# EAGLE design VESC_Dev_1 (EAGLE 9.4.2)

## Sheet 1 of 6
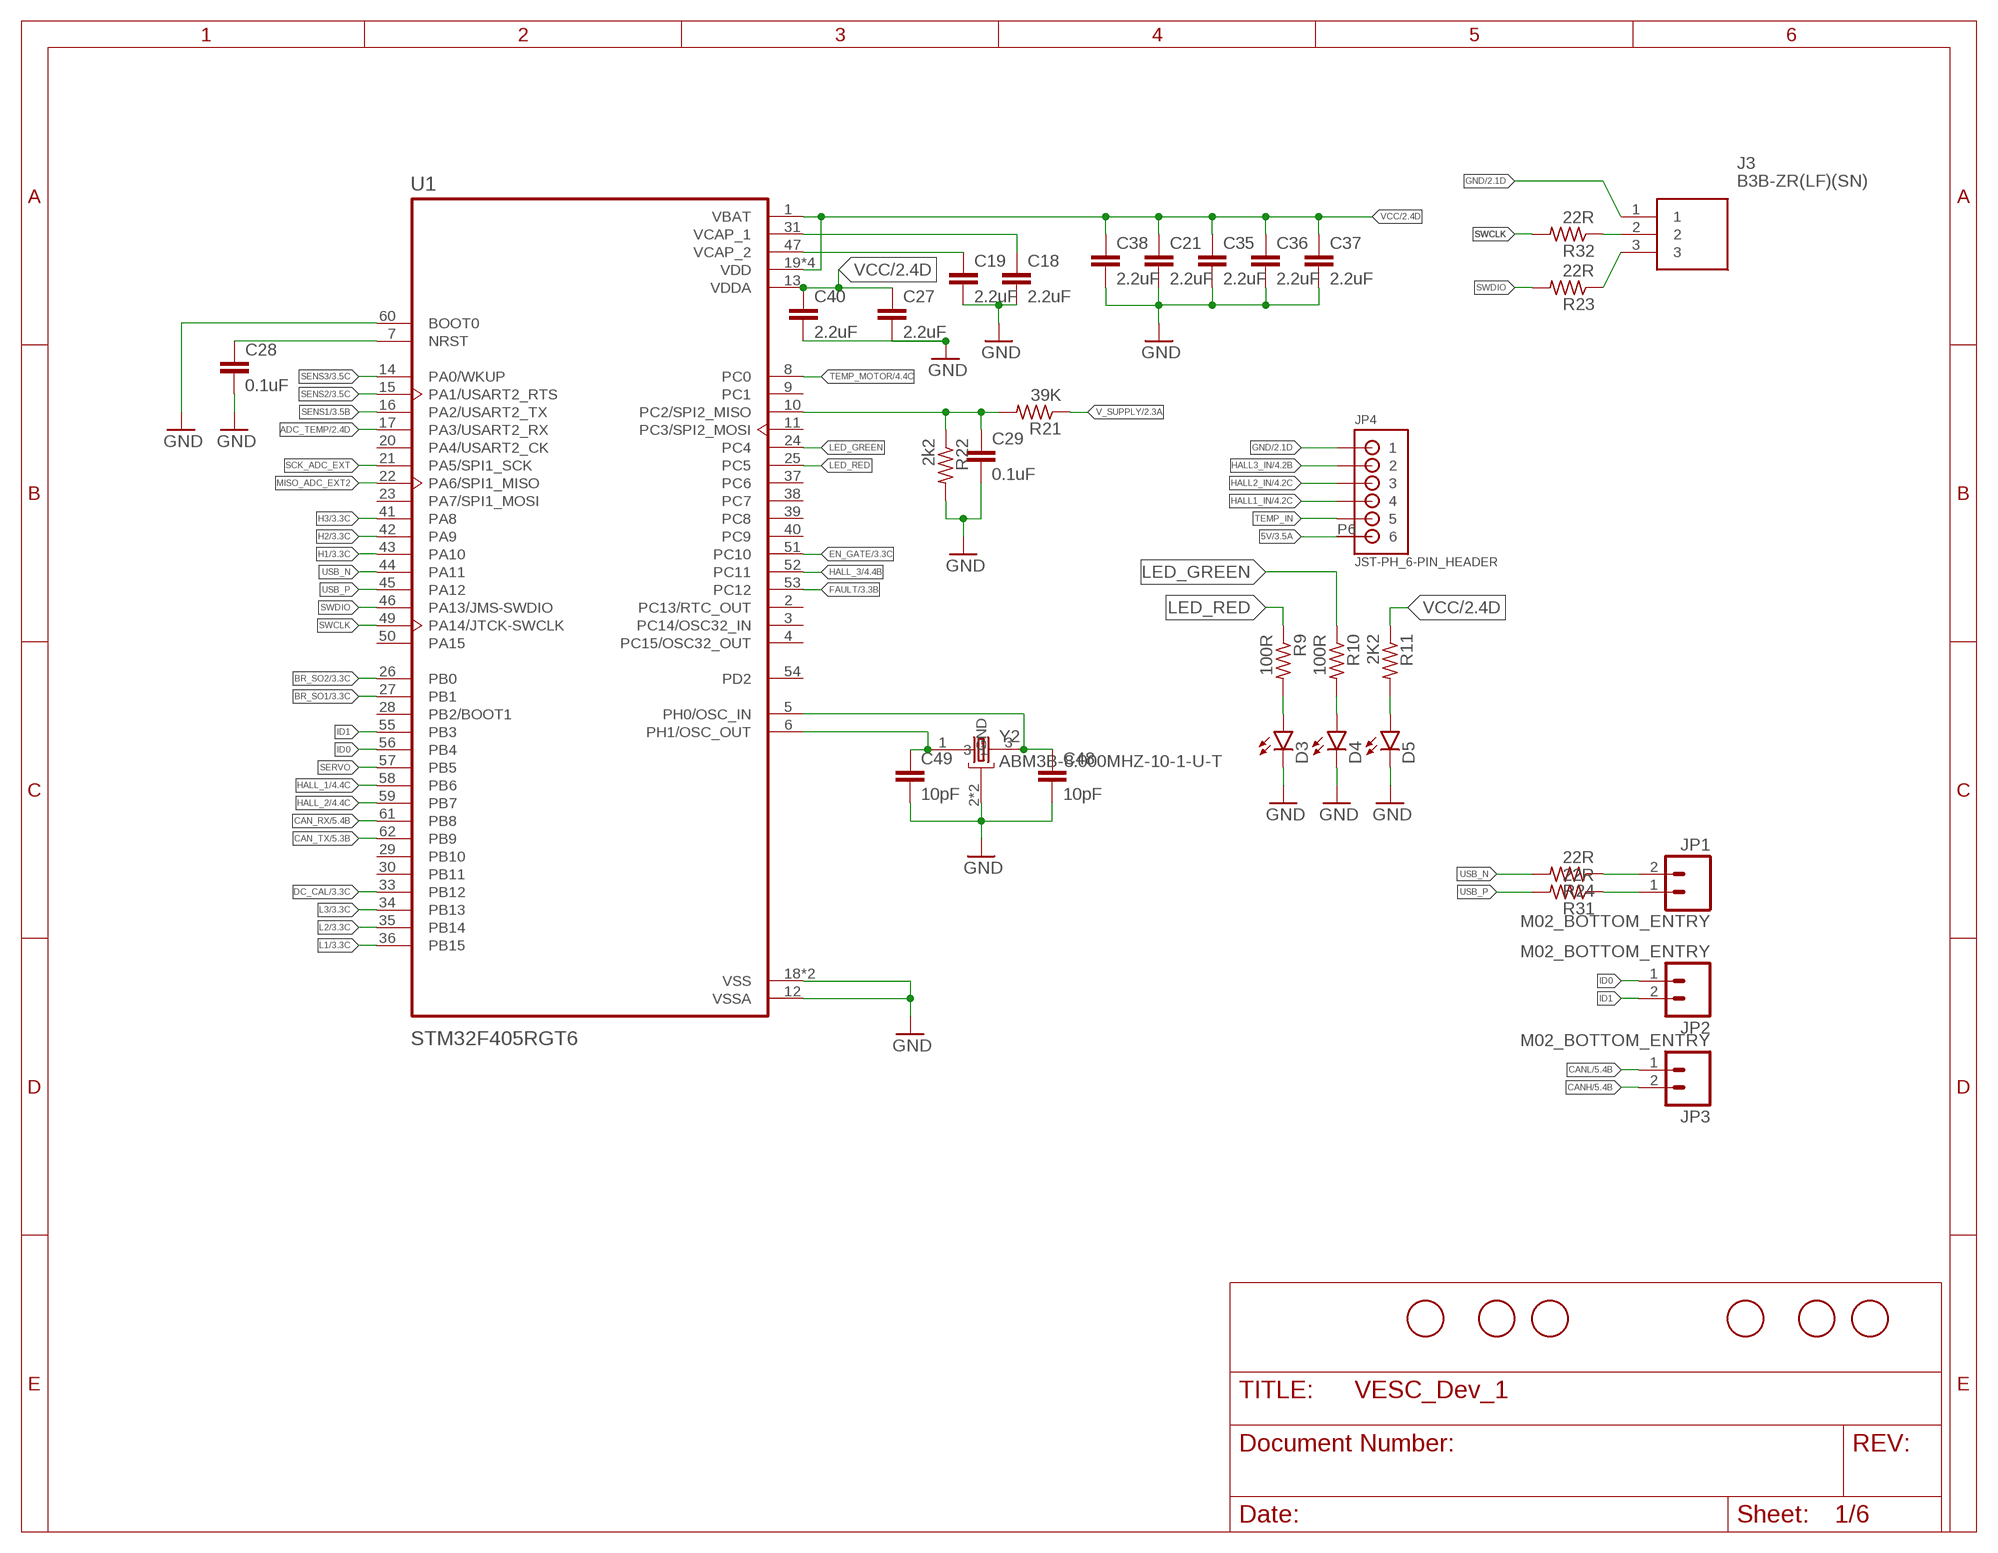
[diagram p0: schematic, sheet 1]

### Parts
C18  2.2uF  C-EUC0603  [C0603]
C19  2.2uF  C-EUC0603  [C0603]
C21  2.2uF  C-EUC0603  [C0603]
C27  2.2uF  C-EUC0603  [C0603]
C28  0.1uF  C-EUC0603  [C0603]
C29  0.1uF  C-EUC0603  [C0603]
C35  2.2uF  C-EUC0603  [C0603]
C36  2.2uF  C-EUC0402  [C0402]
C37  2.2uF  C-EUC0603  [C0603]
C38  2.2uF  C-EUC0603  [C0603]
C40  2.2uF  C-EUC0603  [C0603]
C48  10pF  C-EUC0603  [C0603]
C49  10pF  C-EUC0603  [C0603]
D3  LEDSML0603  [SML0603]
D4  LEDSML0603  [SML0603]
D5  LEDSML0603  [SML0603]
J3  B3B-ZR(LF)(SN)  [SHDR3W50P0X150_1X3_600X350X450]
JP1  M02_BOTTOM_ENTRY  [1X02_BOTTOM_ENTRY]
JP2  M02_BOTTOM_ENTRY  [1X02_BOTTOM_ENTRY]
JP3  M02_BOTTOM_ENTRY  [1X02_BOTTOM_ENTRY]
JP4  JST-PH_6-PIN_HEADER  [JST_B6B-PH_HEADER]
R9  100R  R-US_R0603  [R0603]
R10  100R  R-US_R0603  [R0603]
R11  2K2  R-US_R0603  [R0603]
R21  39K  R-US_R0603  [R0603]
R22  2k2  R-US_R0603  [R0603]
R23  22R  R-US_R0603  [R0603]
R24  22R  R-US_R0603  [R0603]
R31  22R  R-US_R0603  [R0603]
R32  22R  R-US_R0603  [R0603]
U1  STM32F405RGT6  [QFP50P1200X1200X160-64N]
U$1  FIDUCIAL  [FIDUCIAL_1MM]
U$2  FIDUCIAL  [FIDUCIAL_1MM]
U$3  FIDUCIAL  [FIDUCIAL_1MM]
U$4  FIDUCIAL  [FIDUCIAL_1MM]
U$5  FIDUCIAL  [FIDUCIAL_1MM]
U$6  FIDUCIAL  [FIDUCIAL_1MM]
Y2  ABM3B-8.000MHZ-10-1-U-T  [OSCCC500X320X110-4N]

### Nets
5V: JP4.P6 ; also sheet 3
ADC_TEMP: U1.17(PA3/USART2_RX) ; also sheet 2
BR_SO1: U1.27(PB1) ; also sheet 3
BR_SO2: U1.26(PB0) ; also sheet 3
CAN_RX: U1.61(PB8) ; also sheet 5
CAN_TX: U1.62(PB9) ; also sheet 5
CANH: JP3.2 ; also sheet 5
CANL: JP3.1 ; also sheet 5
DC_CAL: U1.33(PB12) ; also sheet 3
EN_GATE: U1.51(PC10) ; also sheet 3
FAULT: U1.53(PC12) ; also sheet 3
GND: C18.2 C19.2 C21.2 C27.2 C28.2 C29.2 C35.2 C36.2 C37.2 C38.2 C40.2 C48.2 C49.2 D3.C D4.C D5.C J3.1 JP4.P1 R22.2 U1.12(VSSA) U1.18(VSS) U1.60(BOOT0) U1.63(VSS) Y2.2(GND) Y2.4(GND) ; also sheet 2,3,4,5
H1: U1.43(PA10) ; also sheet 3
H2: U1.42(PA9) ; also sheet 3
H3: U1.41(PA8) ; also sheet 3
HALL1_IN: JP4.P4 ; also sheet 4
HALL2_IN: JP4.P3 ; also sheet 4
HALL3_IN: JP4.P2 ; also sheet 4
HALL_1: U1.58(PB6) ; also sheet 4
HALL_2: U1.59(PB7) ; also sheet 4
HALL_3: U1.52(PC11) ; also sheet 4
ID0: JP2.1 U1.56(PB4)
ID1: JP2.2 U1.55(PB3)
L1: U1.36(PB15) ; also sheet 3
L2: U1.35(PB14) ; also sheet 3
L3: U1.34(PB13) ; also sheet 3
LED_GREEN: R10.1 U1.24(PC4)
LED_RED: R9.1 U1.25(PC5)
MISO_ADC_EXT2: U1.22(PA6/SPI1_MISO)
N$1: C28.1 U1.7(NRST)
N$4: J3.2 R32.1
N$11: C29.1 R21.2 R22.1 U1.10(PC2/SPI2_MISO)
N$12: JP1.2 R24.1
N$15: C18.1 U1.31(VCAP_1)
N$19: JP1.1 R31.1
N$21: C19.1 U1.47(VCAP_2)
N$22: C49.1 U1.6(PH1/OSC_OUT) Y2.1
N$23: C48.1 U1.5(PH0/OSC_IN) Y2.3
N$26: J3.3 R23.1
N$69: D3.A R9.2
N$71: D4.A R10.2
N$73: D5.A R11.2
SCK_ADC_EXT: U1.21(PA5/SPI1_SCK)
SENS1: U1.16(PA2/USART2_TX) ; also sheet 3
SENS2: U1.15(PA1/USART2_RTS) ; also sheet 3
SENS3: U1.14(PA0/WKUP) ; also sheet 3
SERVO: U1.57(PB5)
SWCLK: R32.2 U1.49(PA14/JTCK-SWCLK)
SWDIO: R23.2 U1.46(PA13/JMS-SWDIO)
TEMP_IN: JP4.P5
TEMP_MOTOR: U1.8(PC0) ; also sheet 4
USB_N [USB]: R24.2 U1.44(PA11)
USB_P [USB]: R31.2 U1.45(PA12)
V_SUPPLY: R21.1 ; also sheet 2,3
VCC: C21.1 C27.1 C35.1 C36.1 C37.1 C38.1 C40.1 R11.1 U1.1(VBAT) U1.13(VDDA) U1.19(VDD) U1.32(VDD) U1.48(VDD) U1.64(VDD) ; also sheet 2,3,4,5
Unconnected: U1.2(PC13/RTC_OUT) U1.3(PC14/OSC32_IN) U1.4(PC15/OSC32_OUT) U1.9(PC1) U1.11(PC3/SPI2_MOSI) U1.20(PA4/USART2_CK) U1.23(PA7/SPI1_MOSI) U1.28(PB2/BOOT1) U1.29(PB10) U1.30(PB11) U1.37(PC6) U1.38(PC7) U1.39(PC8) U1.40(PC9) U1.50(PA15) U1.54(PD2)

## Sheet 2 of 6
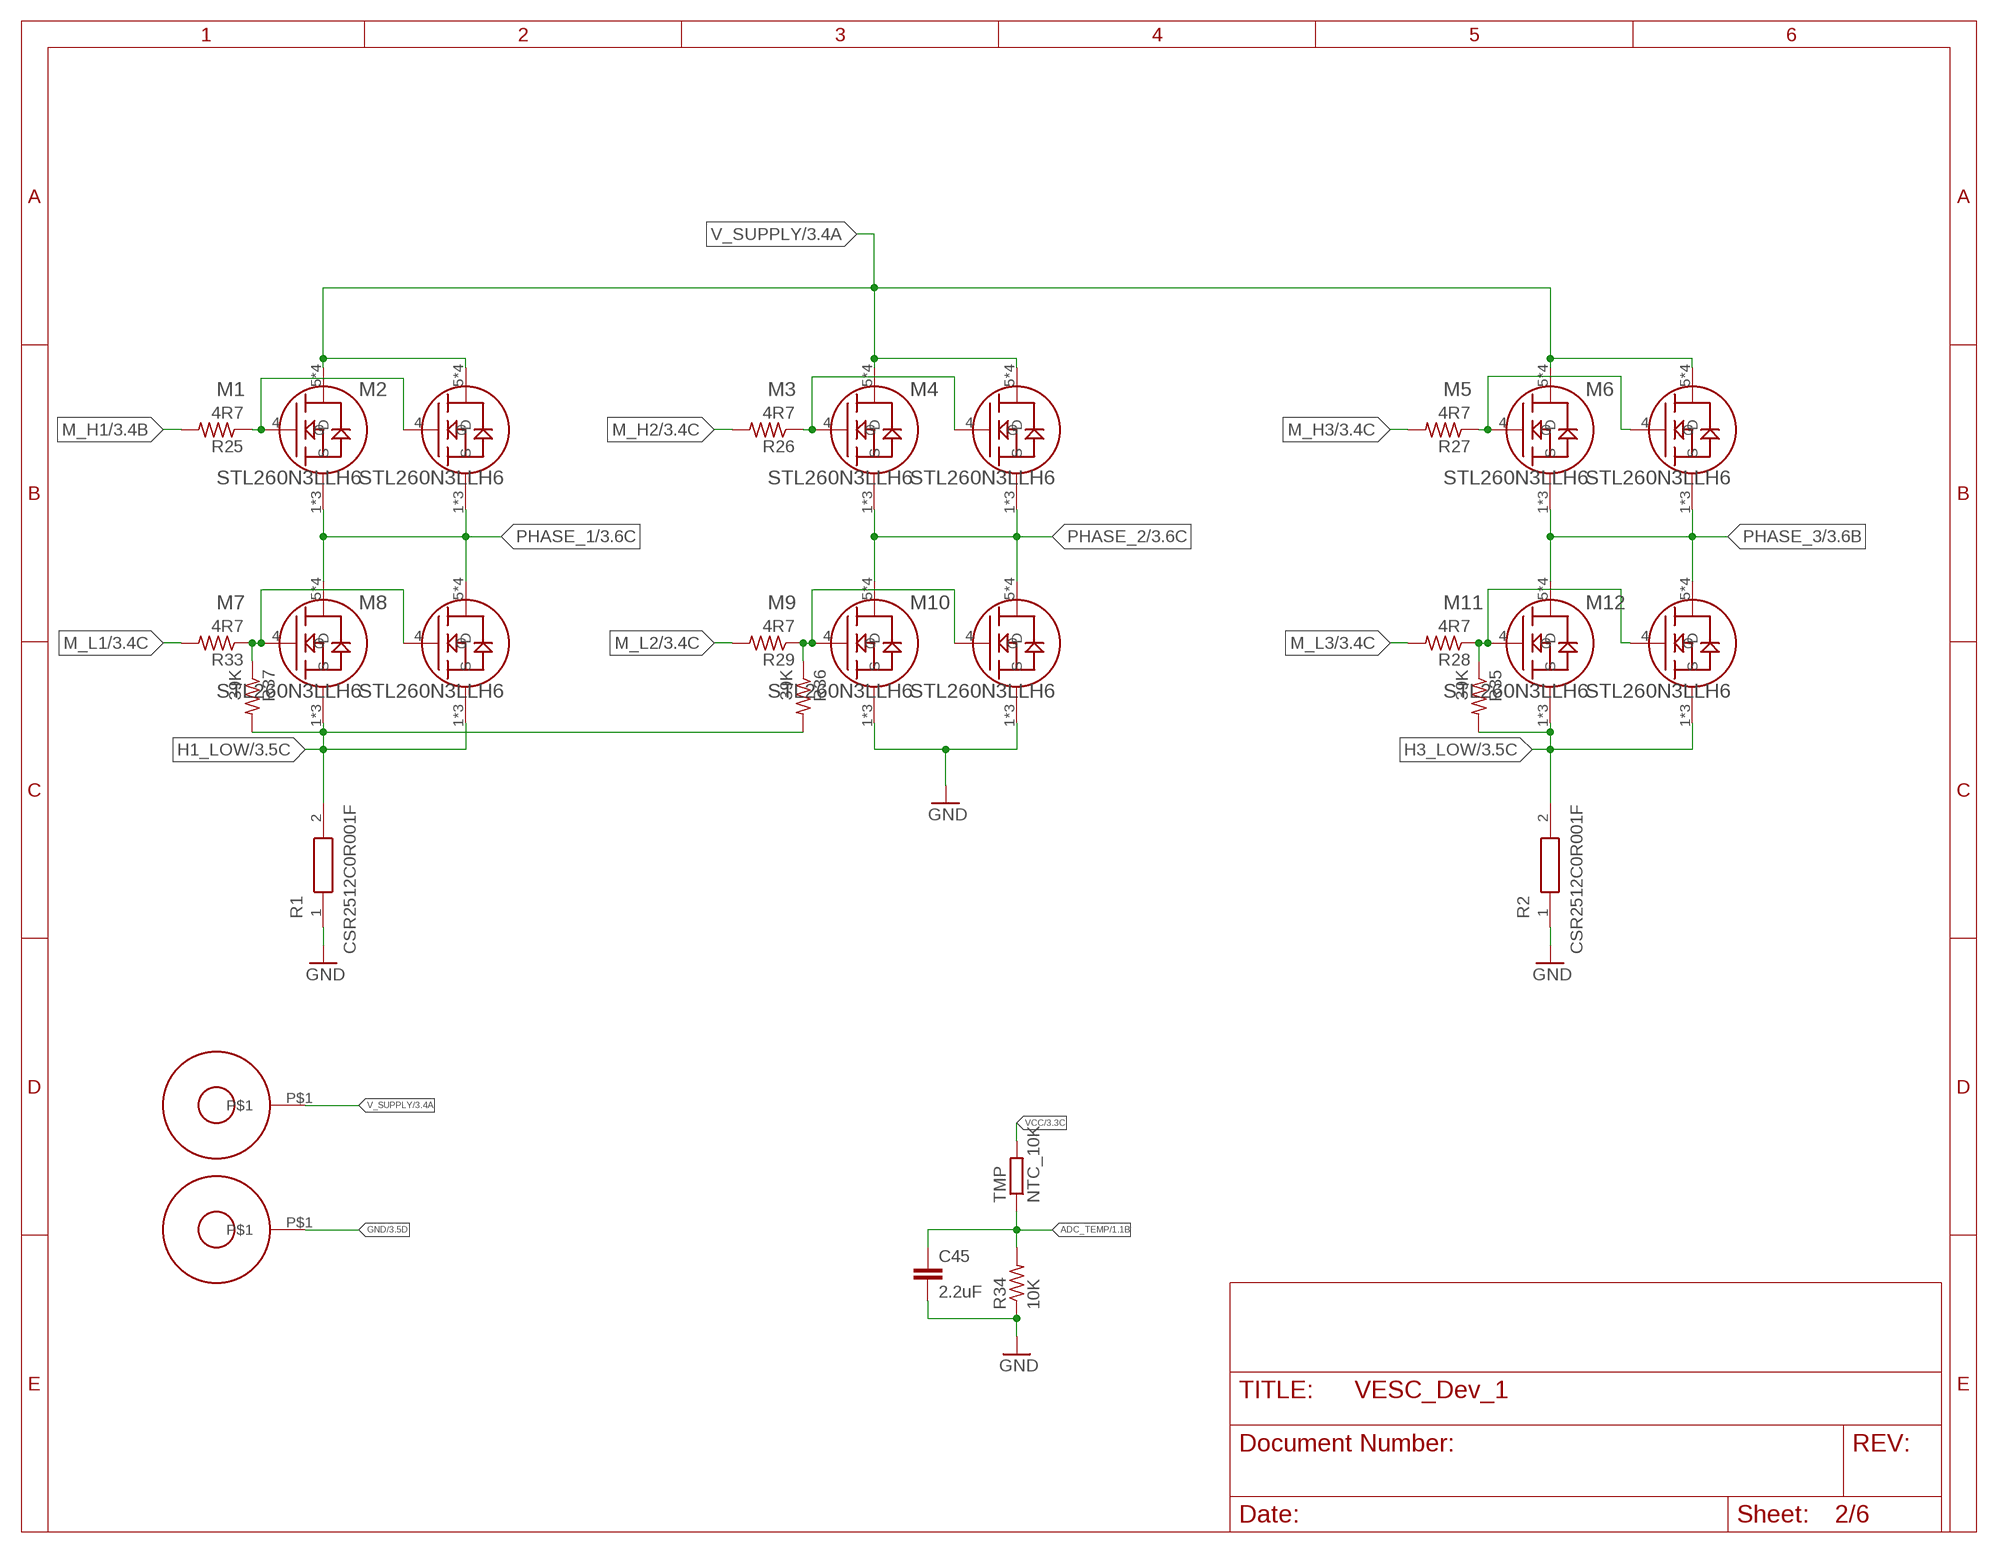
[diagram p1: schematic, sheet 2]

### Parts
C45  2.2uF  C-EUC0603  [C0603]
M1  STL260N3LLH6  [TRANS_STL60P4LLF6]
M2  STL260N3LLH6  [TRANS_STL60P4LLF6]
M3  STL260N3LLH6  [TRANS_STL60P4LLF6]
M4  STL260N3LLH6  [TRANS_STL60P4LLF6]
M5  STL260N3LLH6  [TRANS_STL60P4LLF6]
M6  STL260N3LLH6  [TRANS_STL60P4LLF6]
M7  STL260N3LLH6  [TRANS_STL60P4LLF6]
M8  STL260N3LLH6  [TRANS_STL60P4LLF6]
M9  STL260N3LLH6  [TRANS_STL60P4LLF6]
M10  STL260N3LLH6  [TRANS_STL60P4LLF6]
M11  STL260N3LLH6  [TRANS_STL60P4LLF6]
M12  STL260N3LLH6  [TRANS_STL60P4LLF6]
R1  CSR2512C0R001F  [RESC6432X85N]
R2  CSR2512C0R001F  [RESC6432X85N]
R25  4R7  R-US_R0603  [R0603]
R26  4R7  R-US_R0603  [R0603]
R27  4R7  R-US_R0603  [R0603]
R28  4R7  R-US_R0603  [R0603]
R29  4R7  R-US_R0603  [R0603]
R33  4R7  R-US_R0603  [R0603]
R34  10K  R-US_R0603  [R0603]
R35  39K  R-US_R0603  [R0603]
R36  39K  R-US_R0603  [R0603]
R37  39K  R-US_R0603  [R0603]
TMP  NTC_10K  R-EU_R0402  [R0402]
U$7  M3_POWER_HOLE  [M3_POWER_HOLE]
U$8  M3_POWER_HOLE  [M3_POWER_HOLE]

### Nets
ADC_TEMP: C45.1 R34.2 TMP.1 ; also sheet 1
GND: C45.2 M9.1(S) M9.2(S) M9.3(S) M10.1(S) M10.2(S) M10.3(S) R1.1 R2.1 R34.1 U$8.P$1 ; also sheet 1,3,4,5
H1_LOW: M7.1(S) M7.2(S) M7.3(S) M8.1(S) M8.2(S) M8.3(S) R1.2 R36.2 R37.2 ; also sheet 3
H3_LOW: M11.1(S) M11.2(S) M11.3(S) M12.1(S) M12.2(S) M12.3(S) R2.2 R35.2 ; also sheet 3
M_H1: R25.2 ; also sheet 3
M_H2: R26.2 ; also sheet 3
M_H3: R27.2 ; also sheet 3
M_L1: R33.2 ; also sheet 3
M_L2: R29.2 ; also sheet 3
M_L3: R28.2 ; also sheet 3
N$5: M1.4(G) M2.4(G) R25.1
N$18: M11.4(G) M12.4(G) R28.1 R35.1
N$25: M7.4(G) M8.4(G) R33.1 R37.1
N$28: M3.4(G) M4.4(G) R26.1
N$29: M9.4(G) M10.4(G) R29.1 R36.1
N$35: M5.4(G) M6.4(G) R27.1
PHASE_1: M1.1(S) M1.2(S) M1.3(S) M2.1(S) M2.2(S) M2.3(S) M7.5(D) M7.6(D) M7.7(D) M7.8(D) M8.5(D) M8.6(D) M8.7(D) M8.8(D) ; also sheet 3
PHASE_2: M3.1(S) M3.2(S) M3.3(S) M4.1(S) M4.2(S) M4.3(S) M9.5(D) M9.6(D) M9.7(D) M9.8(D) M10.5(D) M10.6(D) M10.7(D) M10.8(D) ; also sheet 3
PHASE_3: M5.1(S) M5.2(S) M5.3(S) M6.1(S) M6.2(S) M6.3(S) M11.5(D) M11.6(D) M11.7(D) M11.8(D) M12.5(D) M12.6(D) M12.7(D) M12.8(D) ; also sheet 3
V_SUPPLY: M1.5(D) M1.6(D) M1.7(D) M1.8(D) M2.5(D) M2.6(D) M2.7(D) M2.8(D) M3.5(D) M3.6(D) M3.7(D) M3.8(D) M4.5(D) M4.6(D) M4.7(D) M4.8(D) M5.5(D) M5.6(D) M5.7(D) M5.8(D) M6.5(D) M6.6(D) M6.7(D) M6.8(D) U$7.P$1 ; also sheet 1,3
VCC: TMP.2 ; also sheet 1,3,4,5

## Sheet 3 of 6
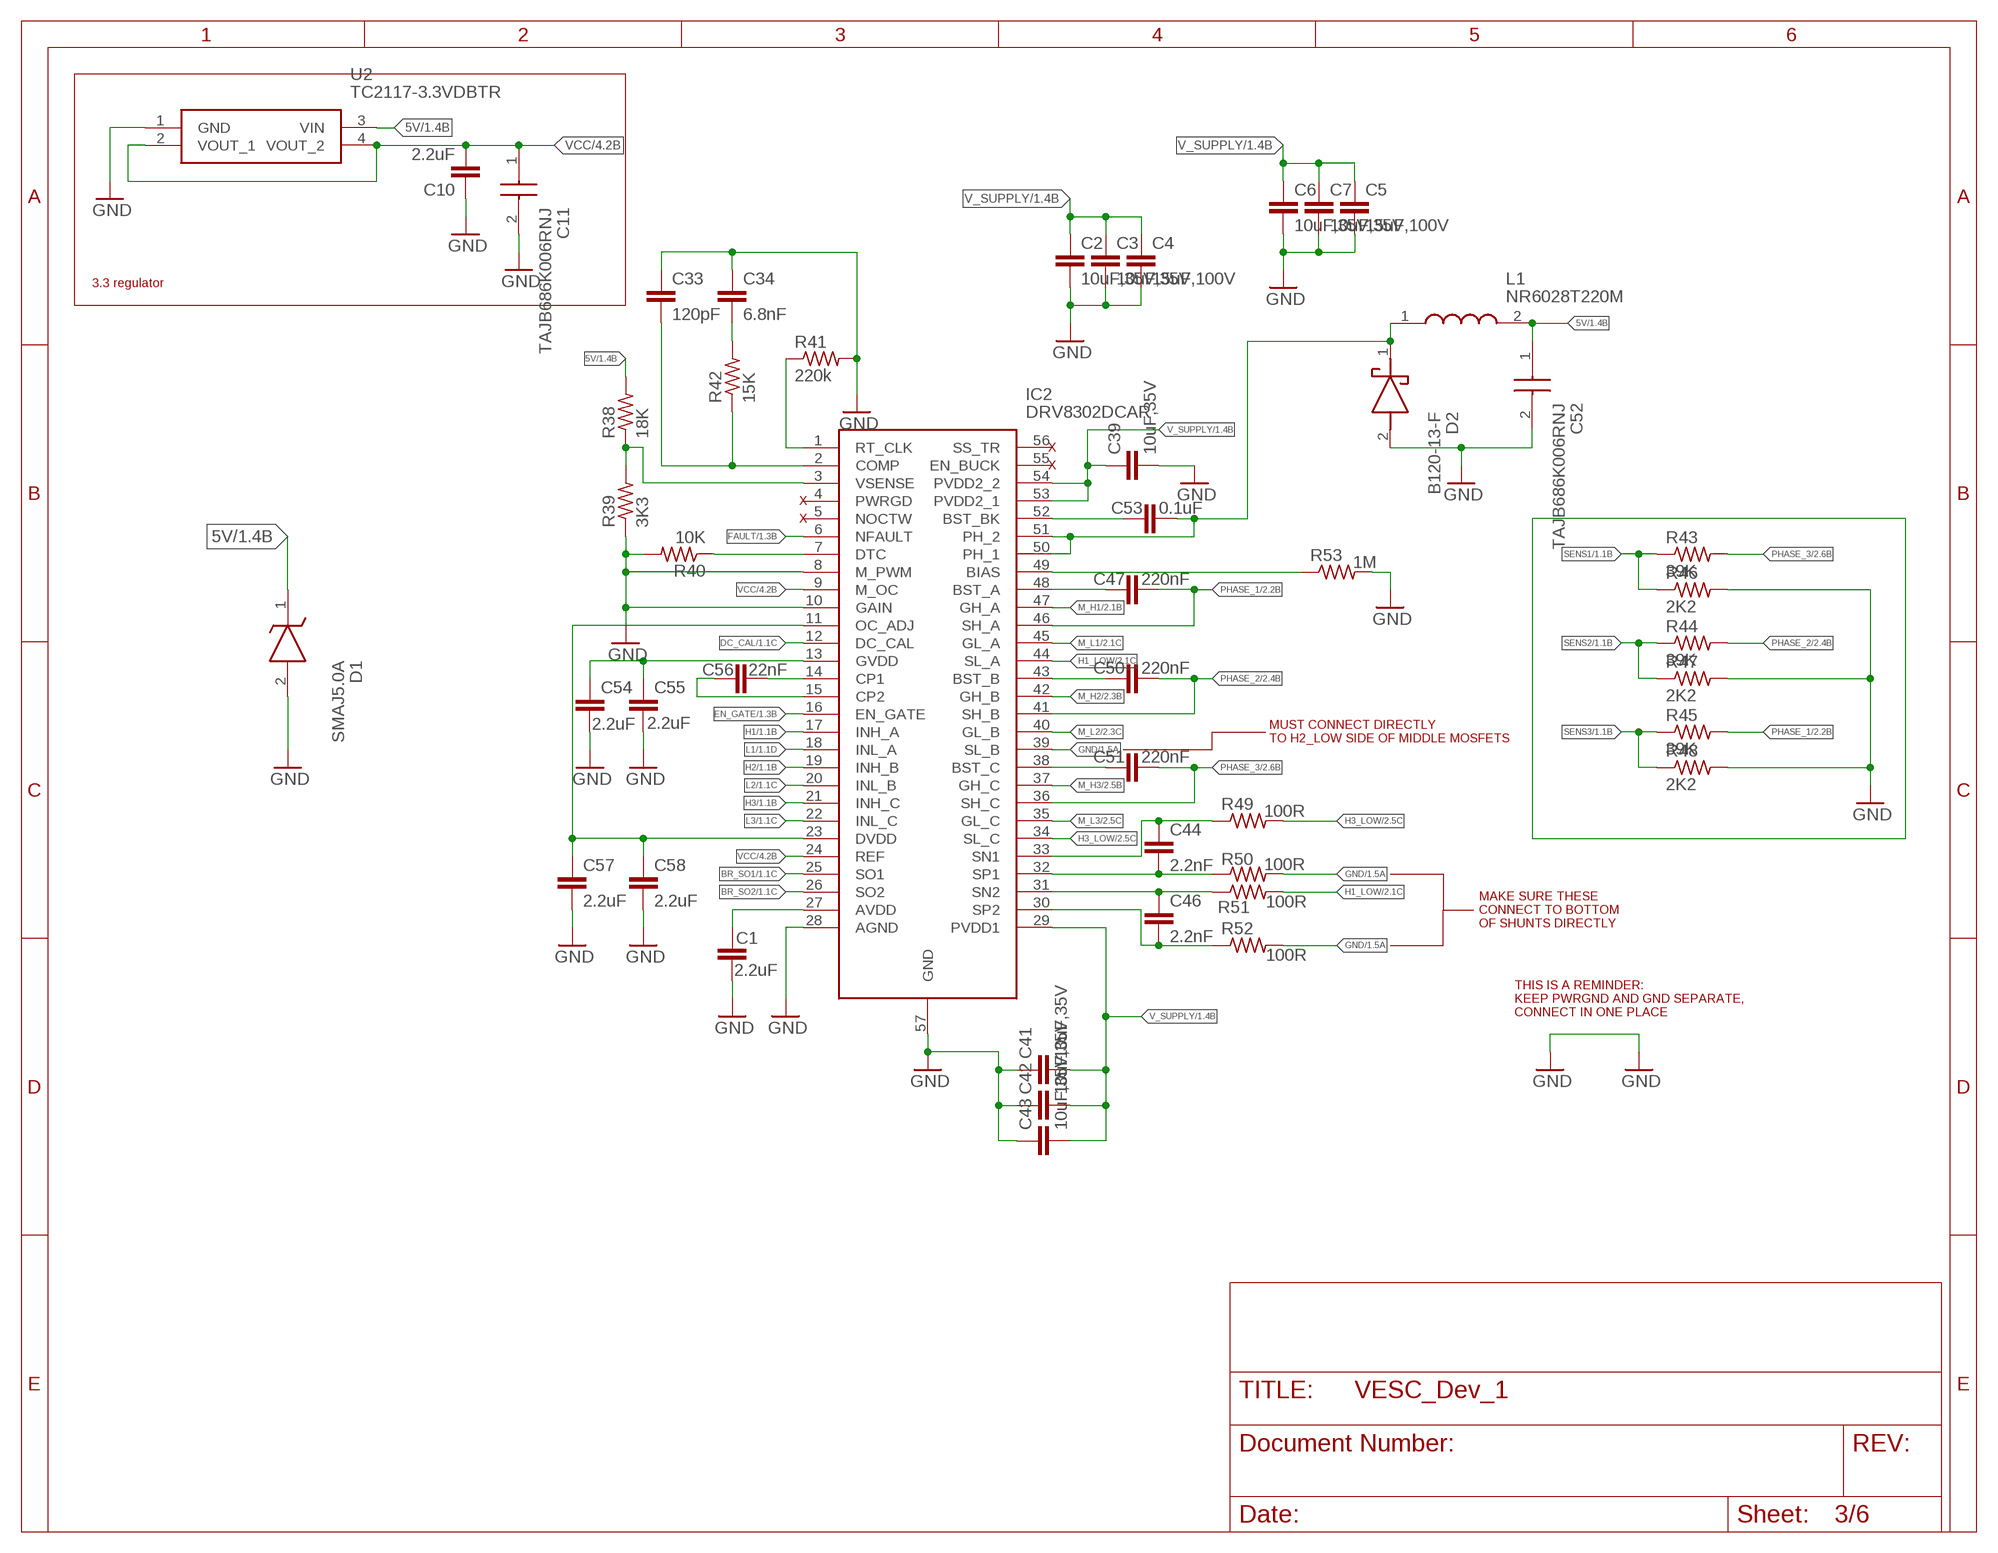
[diagram p2: schematic, sheet 3]

### Parts
C1  2.2uF  C-EUC0603  [C0603]
C2  10uF,35V  C-EUC0805  [C0805]
C3  10uF,35V  C-EUC0805  [C0805]
C4  15uF,100V  C-EUC2220K  [C2220K]
C5  15uF,100V  C-EUC2220K  [C2220K]
C6  10uF,35V  C-EUC0805  [C0805]
C7  10uF,35V  C-EUC0805  [C0805]
C10  2.2uF  C-EUC0805  [C0805]
C11  TAJB686K006RNJ  [CAPPM3528X210N]
C33  120pF  C-EUC0402  [C0402]
C34  6.8nF  C-EUC0402  [C0402]
C39  10uF,35V  C-EUC0805  [C0805]
C41  10uF,35V  C-EUC0805  [C0805]
C42  10uF,35V  C-EUC0805  [C0805]
C43  10uF,35V  C-EUC0805  [C0805]
C44  2.2nF  C-EUC0402  [C0402]
C46  2.2nF  C-EUC0402  [C0402]
C47  220nF  C-EUC0402  [C0402]
C50  220nF  C-EUC0402  [C0402]
C51  220nF  C-EUC0402  [C0402]
C52  TAJB686K006RNJ  [CAPPM3528X210N]
C53  0.1uF  C-EUC0603  [C0603]
C54  2.2uF  C-EUC0603  [C0603]
C55  2.2uF  C-EUC0603  [C0603]
C56  22nF  C-EUC0402  [C0402]
C57  2.2uF  C-EUC0402  [C0402]
C58  2.2uF  C-EUC0402  [C0402]
D1  SMAJ5.0A  [DIOM5026X229N]
D2  B120-13-F  [DIOM5226X240N]
IC2  DRV8302DCAR  [SOP50P810X120-57N]
L1  NR6028T220M  [NR6028T220M]
R38  18K  R-US_R0402  [R0402]
R39  3K3  R-US_R0402  [R0402]
R40  10K  R-US_R0603  [R0603]
R41  220k  R-US_R0402  [R0402]
R42  15K  R-US_R0402  [R0402]
R43  39K  R-US_R0603  [R0603]
R44  39K  R-US_R0603  [R0603]
R45  39K  R-US_R0603  [R0603]
R46  2K2  R-US_R0603  [R0603]
R47  2K2  R-US_R0603  [R0603]
R48  2K2  R-US_R0603  [R0603]
R49  100R  R-US_R0402  [R0402]
R50  100R  R-US_R0402  [R0402]
R51  100R  R-US_R0402  [R0402]
R52  100R  R-US_R0402  [R0402]
R53  1M  R-US_R0603  [R0603]
U2  TC2117-3.3VDBTR  [SOT230P700X180-4N]

### Nets
5V: C52.1(+) D1.1(K) L1.2 R38.2 U2.3(VIN) ; also sheet 1
BR_SO1: IC2.25(SO1) ; also sheet 1
BR_SO2: IC2.26(SO2) ; also sheet 1
DC_CAL: IC2.12(DC_CAL) ; also sheet 1
EN_GATE: IC2.16(EN_GATE) ; also sheet 1
FAULT: IC2.6(NFAULT) ; also sheet 1
GND: C1.2 C2.2 C3.2 C4.2 C5.2 C6.2 C7.2 C10.1 C11.2(-) C33.1 C34.1 C39.2 C41.1 C42.1 C43.1 C52.2(-) C54.2 C55.2 C57.2 C58.2 D1.2(A) D2.2(A) IC2.8(M_PWM) IC2.10(GAIN) IC2.28(AGND) IC2.39(SL_B) IC2.57(GND) R39.1 R40.2 R41.2 R46.2 R47.2 R48.2 R50.2 R52.2 R53.2 U2.1(GND) ; also sheet 1,2,4,5
H1: IC2.17(INH_A) ; also sheet 1
H1_LOW: IC2.44(SL_A) R51.2 ; also sheet 2
H2: IC2.19(INH_B) ; also sheet 1
H3: IC2.21(INH_C) ; also sheet 1
H3_LOW: IC2.34(SL_C) R49.2 ; also sheet 2
L1: IC2.18(INL_A) ; also sheet 1
L2: IC2.20(INL_B) ; also sheet 1
L3: IC2.22(INL_C) ; also sheet 1
M_H1: IC2.47(GH_A) ; also sheet 2
M_H2: IC2.42(GH_B) ; also sheet 2
M_H3: IC2.37(GH_C) ; also sheet 2
M_L1: IC2.45(GL_A) ; also sheet 2
M_L2: IC2.40(GL_B) ; also sheet 2
M_L3: IC2.35(GL_C) ; also sheet 2
N$2: C57.1 C58.1 IC2.11(OC_ADJ) IC2.23(DVDD)
N$9: IC2.3(VSENSE) R38.1 R39.2
N$10: IC2.7(DTC) R40.1
N$13: C54.1 C55.1 IC2.13(GVDD)
N$14: C56.2 IC2.14(CP1)
N$16: C56.1 IC2.15(CP2)
N$20: IC2.1(RT_CLK) R41.1
N$39: C33.2 IC2.2(COMP) R42.1
N$40: C34.2 R42.2
N$42: C1.1 IC2.27(AVDD)
N$45: IC2.49(BIAS) R53.1
N$49: C46.2 IC2.30(SP2) R52.1
N$50: C46.1 IC2.31(SN2) R51.1
N$51: C44.1 IC2.33(SN1) R49.1
N$52: C44.2 IC2.32(SP1) R50.1
N$53: C51.1 IC2.38(BST_C)
N$58: C50.1 IC2.43(BST_B)
N$63: C47.1 IC2.48(BST_A)
N$64: C53.1 IC2.52(BST_BK)
N$65: C53.2 D2.1(K) IC2.50(PH_1) IC2.51(PH_2) L1.1
PHASE_1: C47.2 IC2.46(SH_A) R45.2 ; also sheet 2
PHASE_2: C50.2 IC2.41(SH_B) R44.2 ; also sheet 2
PHASE_3: C51.2 IC2.36(SH_C) R43.2 ; also sheet 2
SENS1: R43.1 R46.1 ; also sheet 1
SENS2: R44.1 R47.1 ; also sheet 1
SENS3: R45.1 R48.1 ; also sheet 1
V_SUPPLY: C2.1 C3.1 C4.1 C5.1 C6.1 C7.1 C39.1 C41.2 C42.2 C43.2 IC2.29(PVDD1) IC2.53(PVDD2_1) IC2.54(PVDD2_2) ; also sheet 1,2
VCC: C10.2 C11.1(+) IC2.9(M_OC) IC2.24(REF) U2.2(VOUT_1) U2.4(VOUT_2) ; also sheet 1,2,4,5
Unconnected: IC2.4(PWRGD) IC2.5(NOCTW) IC2.55(EN_BUCK) IC2.56(SS_TR)

### Notes on the sheet
- 3.3 regulator
- X
- X
- X
- X
- MUST CONNECT DIRECTLY
  TO H2_LOW SIDE OF MIDDLE MOSFETS
- MAKE SURE THESE 
  CONNECT TO BOTTOM 
  OF SHUNTS DIRECTLY
- THIS IS A REMINDER:
  KEEP PWRGND AND GND SEPARATE,
  CONNECT IN ONE PLACE

## Sheet 4 of 6
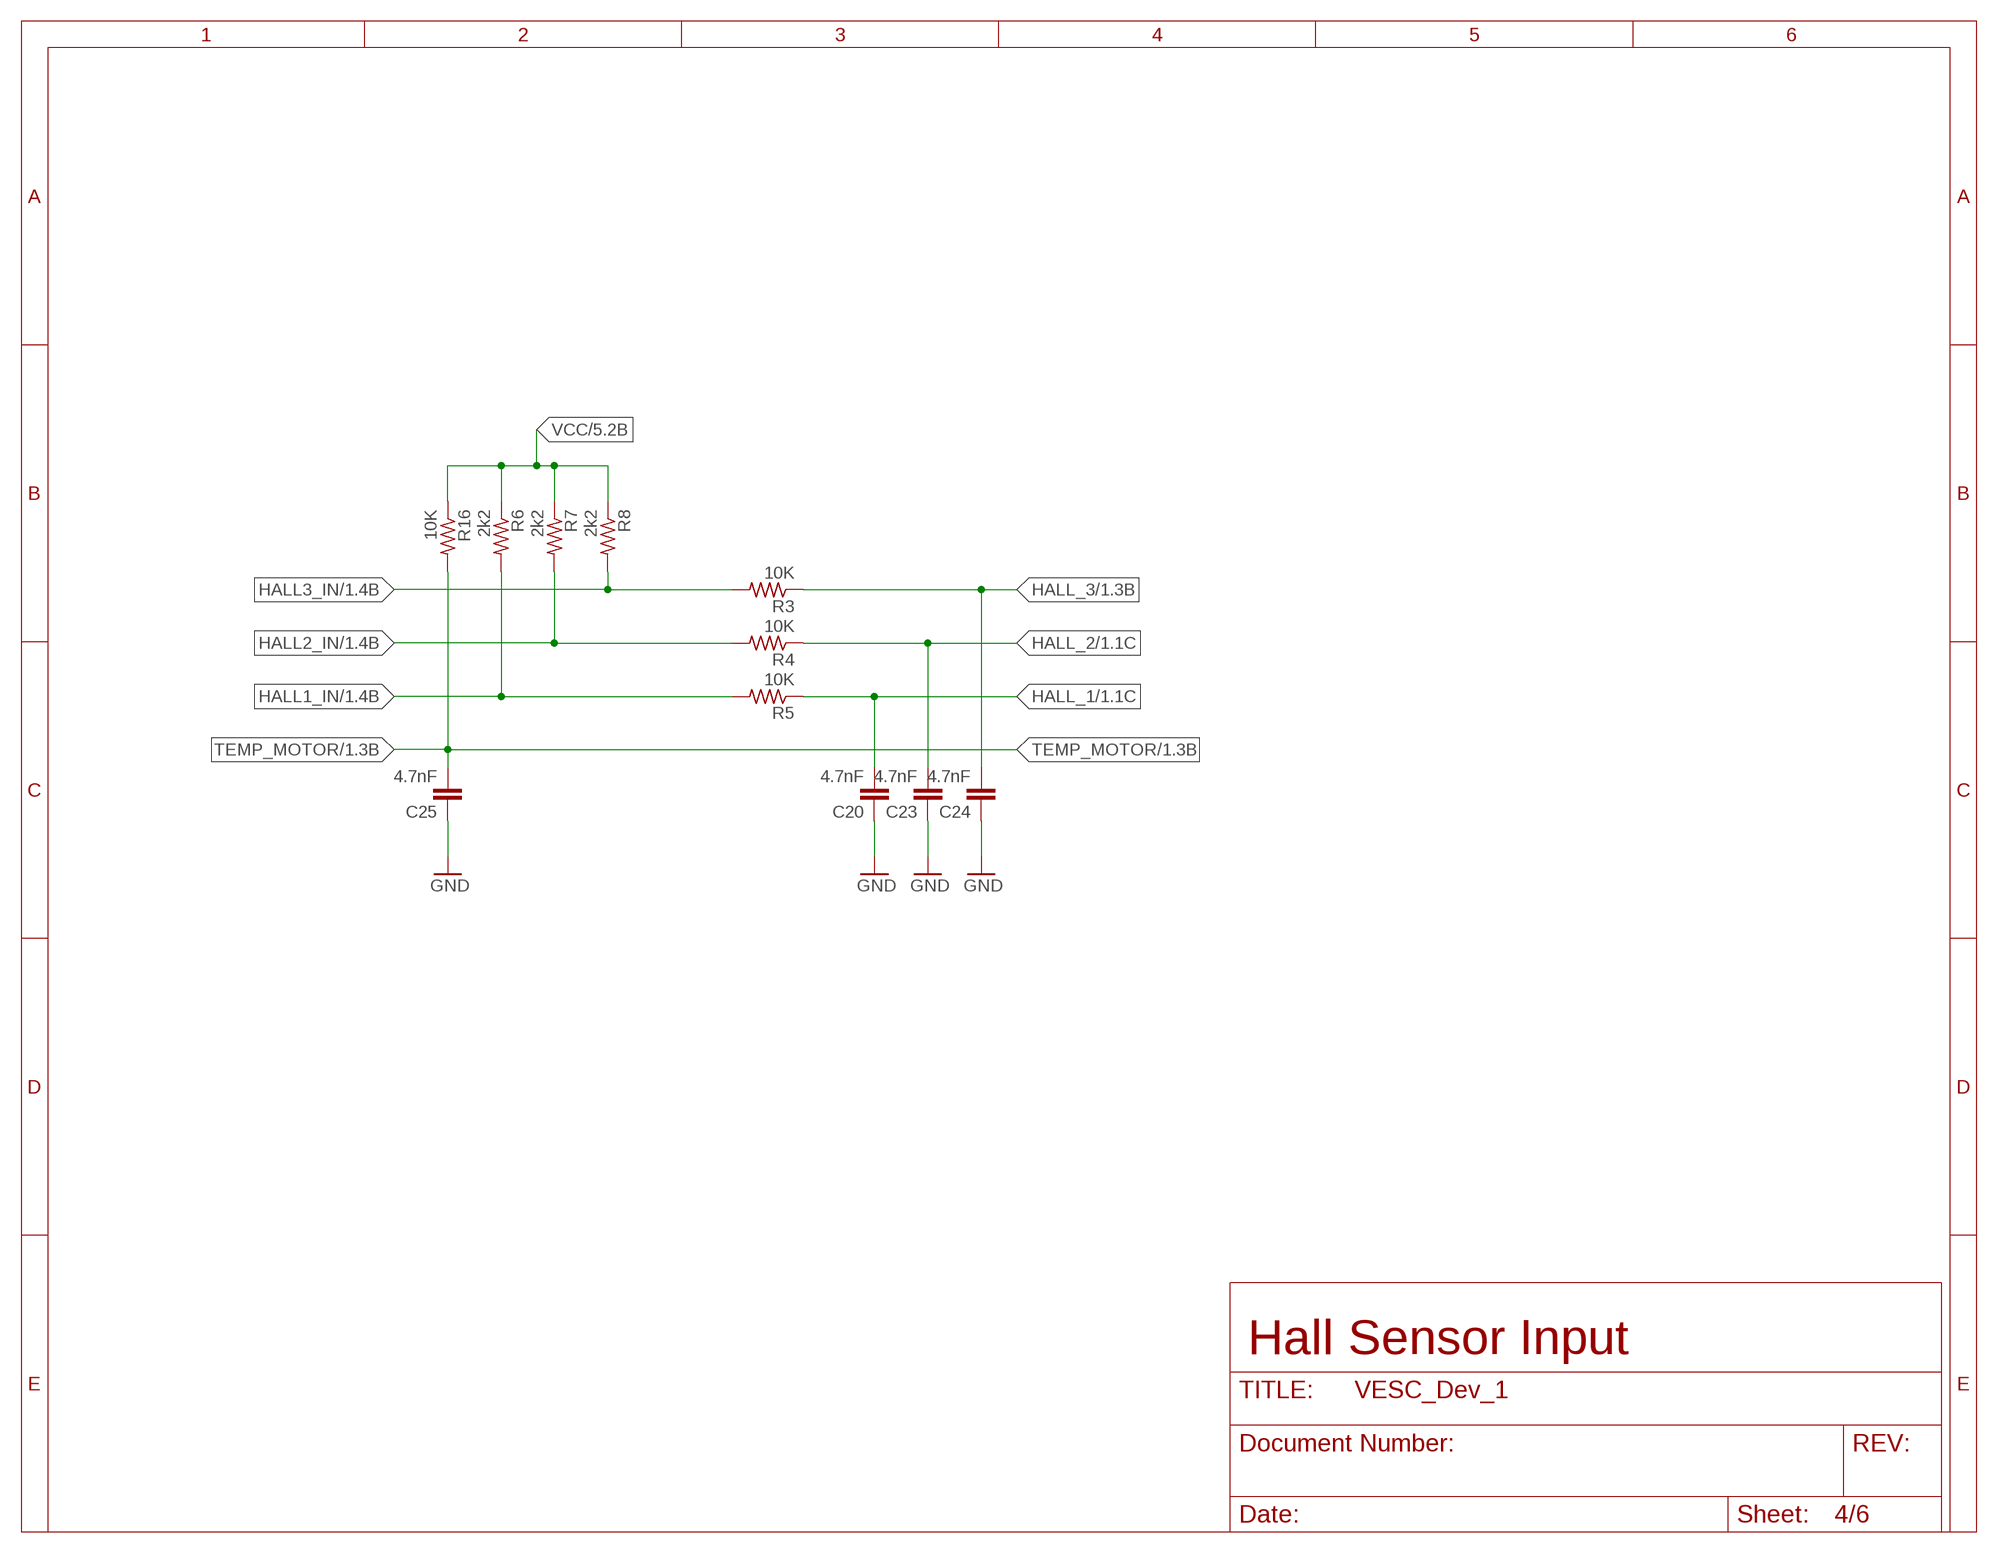
[diagram p3: schematic, sheet 4]

### Parts
C20  4.7nF  C-EUC0603  [C0603]
C23  4.7nF  C-EUC0603  [C0603]
C24  4.7nF  C-EUC0603  [C0603]
C25  4.7nF  C-EUC0603  [C0603]
R3  10K  R-US_R0603  [R0603]
R4  10K  R-US_R0603  [R0603]
R5  10K  R-US_R0603  [R0603]
R6  2k2  R-US_R0603  [R0603]
R7  2k2  R-US_R0603  [R0603]
R8  2k2  R-US_R0603  [R0603]
R16  10K  R-US_R0603  [R0603]

### Nets
GND: C20.1 C23.1 C24.1 C25.1 ; also sheet 1,2,3,5
HALL1_IN: R5.2 R6.2 ; also sheet 1
HALL2_IN: R4.2 R7.2 ; also sheet 1
HALL3_IN: R3.2 R8.2 ; also sheet 1
HALL_1: C20.2 R5.1 ; also sheet 1
HALL_2: C23.2 R4.1 ; also sheet 1
HALL_3: C24.2 R3.1 ; also sheet 1
TEMP_MOTOR: C25.2 R16.2 ; also sheet 1
VCC: R6.1 R7.1 R8.1 R16.1 ; also sheet 1,2,3,5

### Notes on the sheet
- Hall Sensor Input

## Sheet 5 of 6
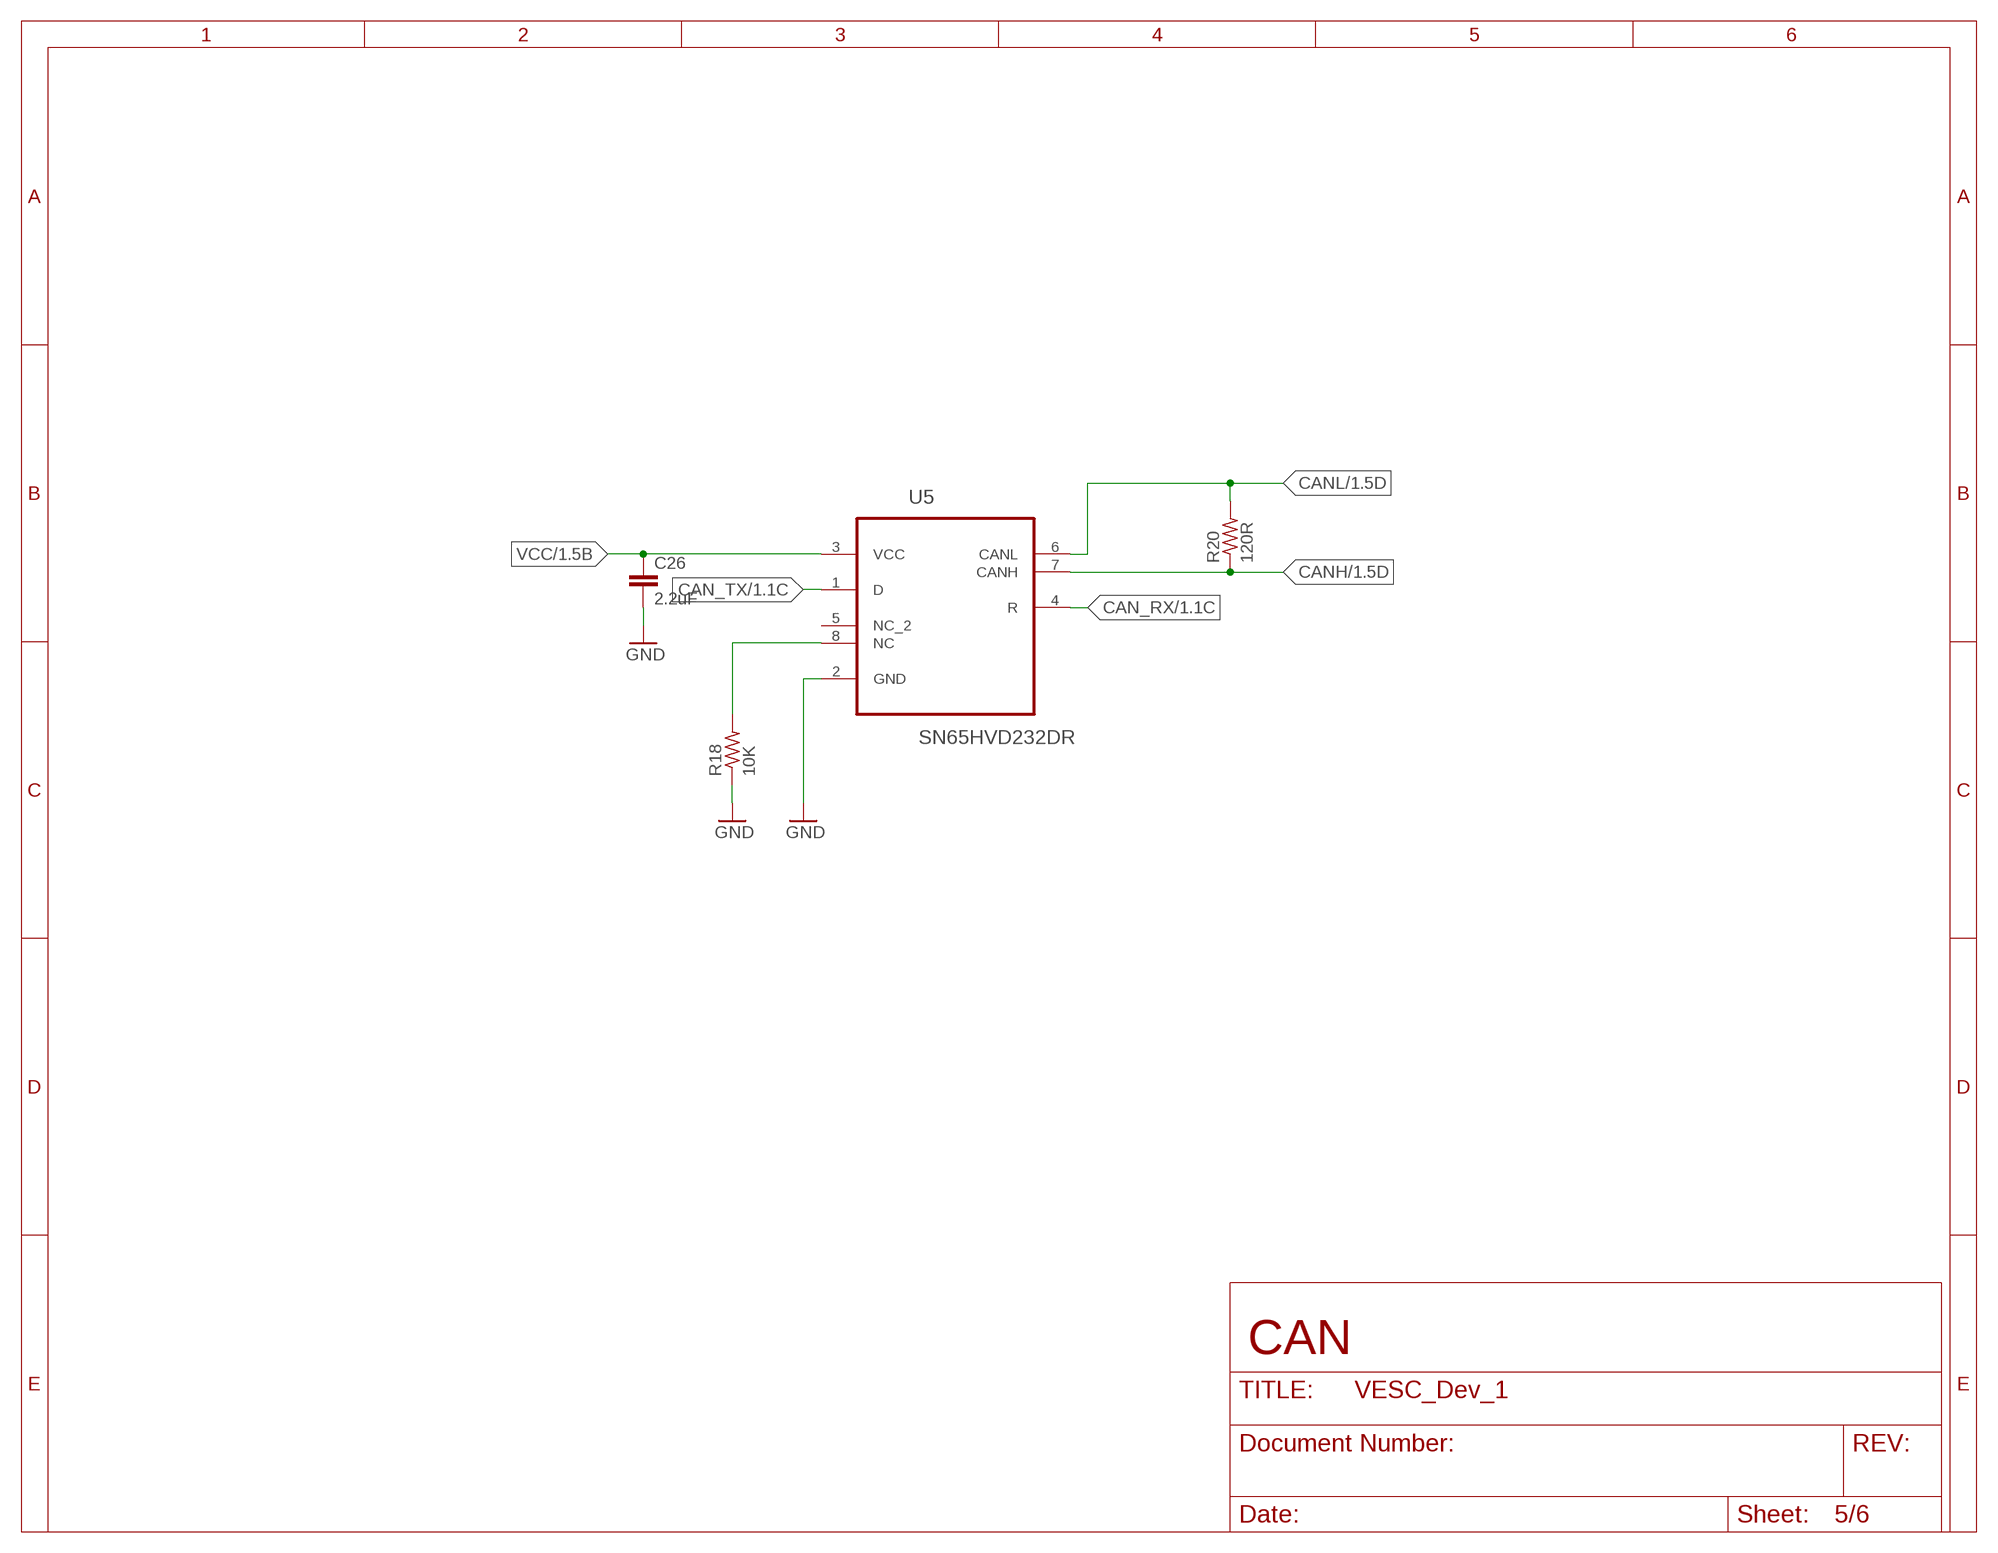
[diagram p4: schematic, sheet 5]

### Parts
C26  2.2uF  C-EUC0603  [C0603]
R18  10K  R-US_R0603  [R0603]
R20  120R  R-US_R0603  [R0603]
U5  SN65HVD232DR  [SOIC127P600X175-8N]

### Nets
CAN_RX: U5.4(R) ; also sheet 1
CAN_TX: U5.1(D) ; also sheet 1
CANH: R20.1 U5.7(CANH) ; also sheet 1
CANL: R20.2 U5.6(CANL) ; also sheet 1
GND: C26.2 R18.1 U5.2(GND) ; also sheet 1,2,3,4
N$3: R18.2 U5.8(NC)
VCC: C26.1 U5.3(VCC) ; also sheet 1,2,3,4
Unconnected: U5.5(NC_2)

### Notes on the sheet
- CAN

## Sheet 6 of 6
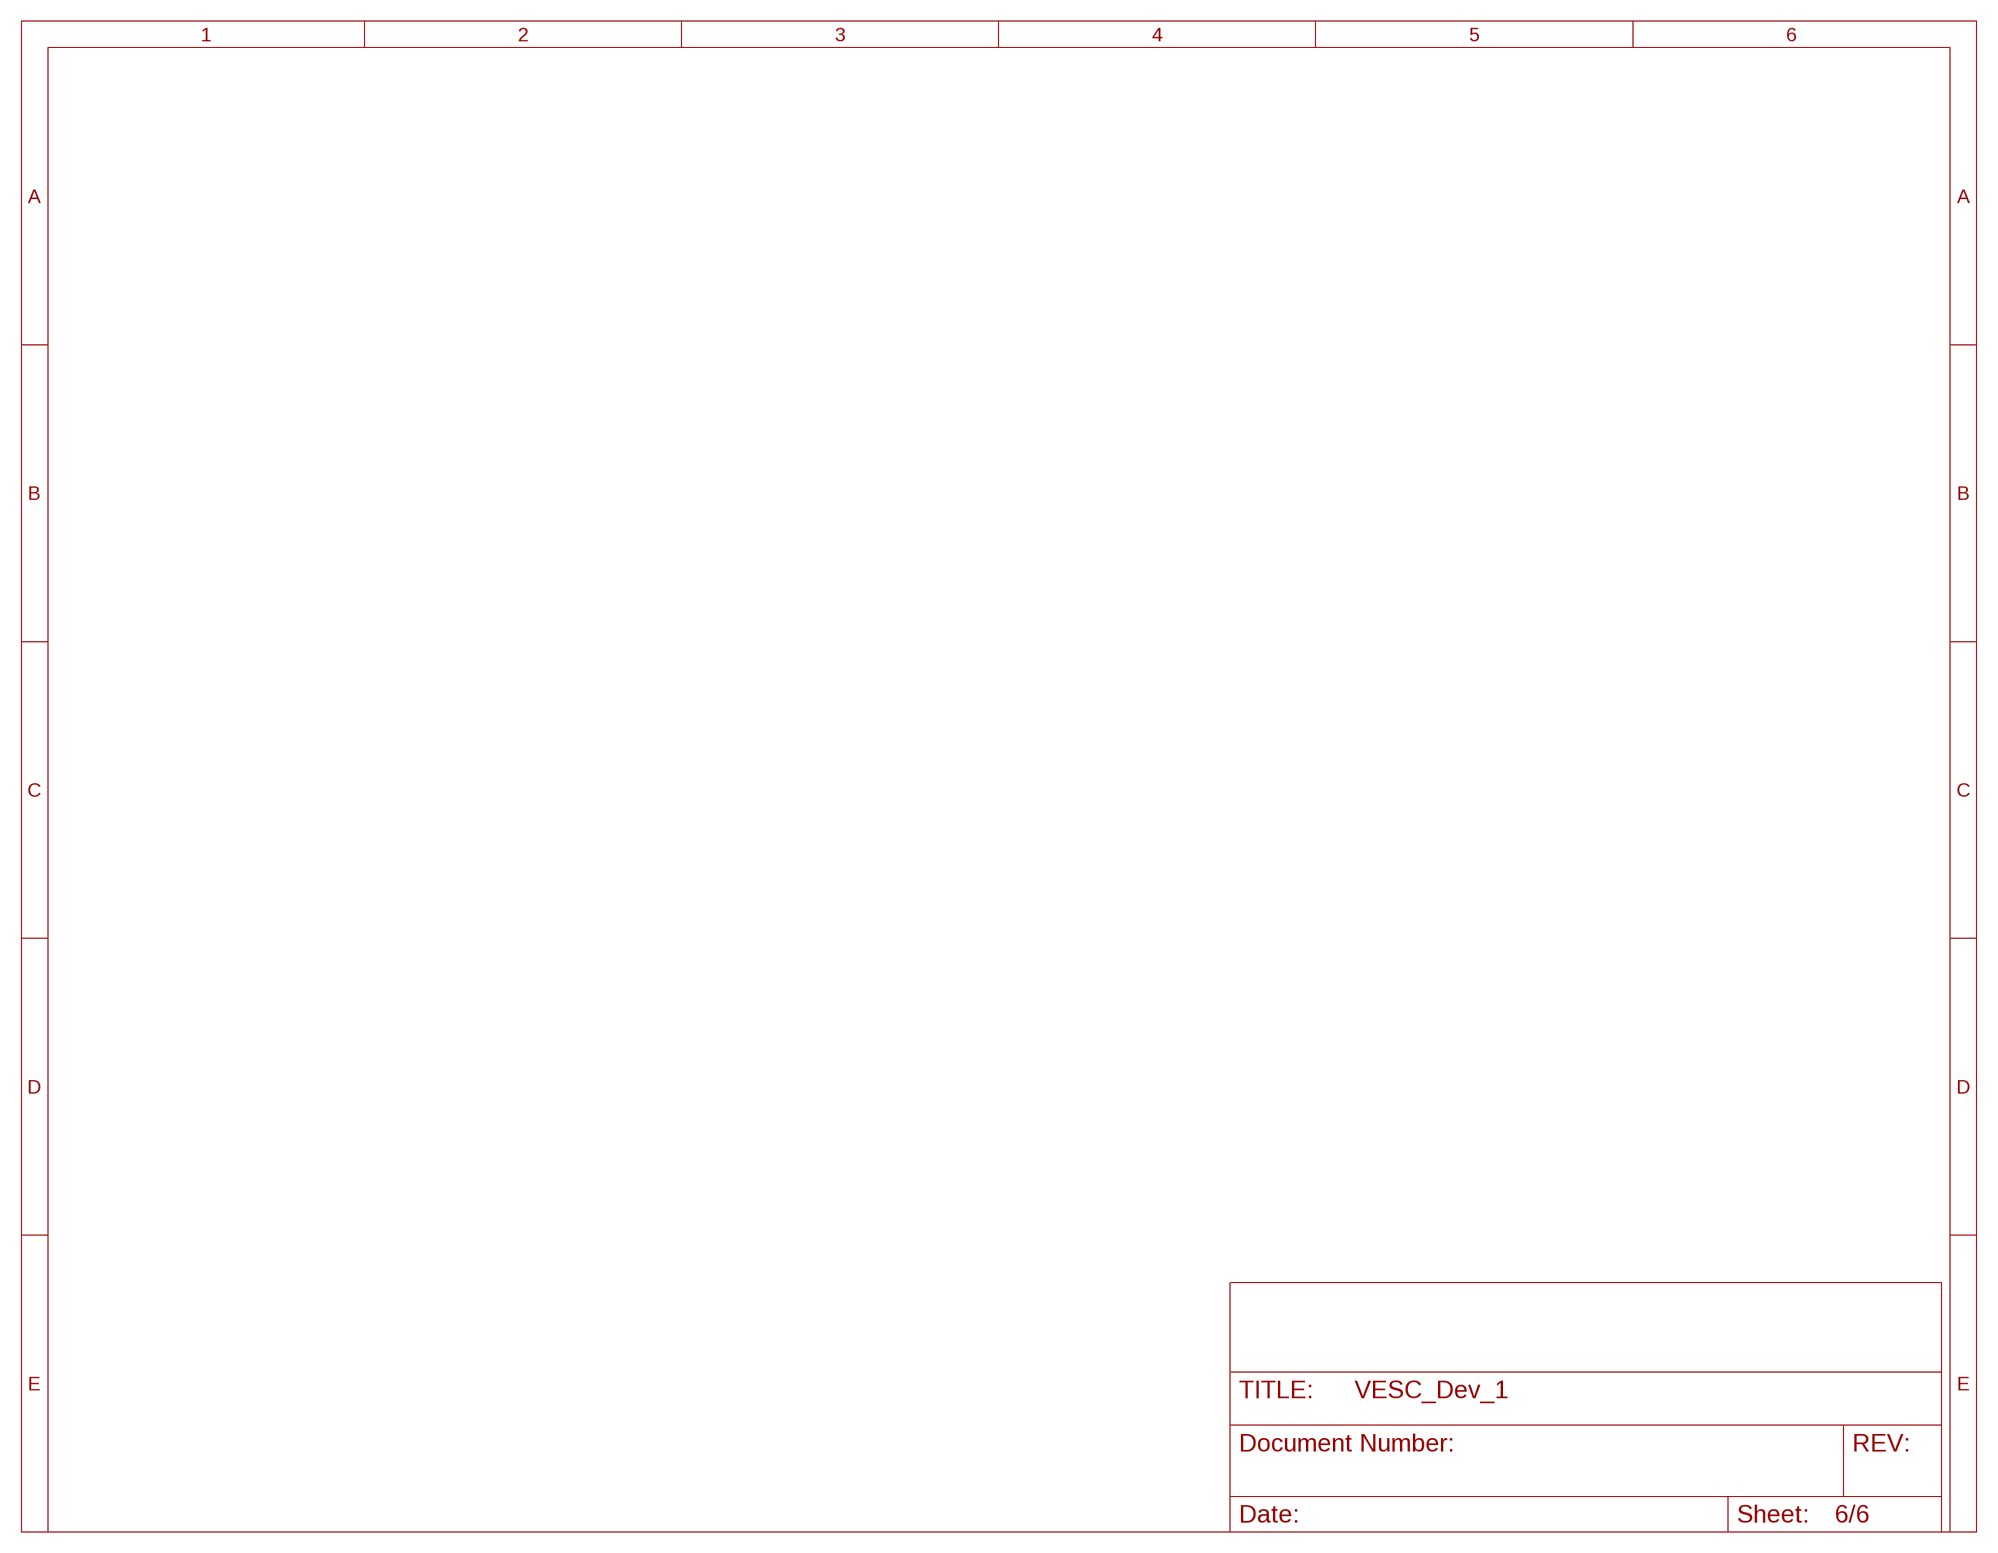
[diagram p5: schematic, sheet 6]

## Library data of the parts
C1-C7 C10 C18-C21 C23-C29 C33-C51 C53-C58 = rcl:C-EU: CAPACITOR, European symbol; SPICEPREFIX: C
C11 C52 = TAJB686K006RNJ:TAJB686K006RNJ: AVX - TAJB686K006RNJ - CAP, TANT, 68UF, 6.3V, CASE B Source: Datasheet <http://www.farnell.com/datasheets/1680476.pdf>; ALLIED_NUMBER: 70001766; ALLIED_PRICE-STOCK: https://www.alliedelec.com/avx-tajb686k006rnj/70001766/; DESCRIPTION: AVX - TAJB686K006RNJ - CAP, TANT, 68UF, 6.3V, CASE B; HEIGHT: 2.1mm; MANUFACTURER_NAME: AVX; MANUFACTURER_PART_NUMBER: TAJB686K006RNJ; MOUSER_PART_NUMBER: 581-TAJB686K006R; MOUSER_PRICE-STOCK: https://www.mouser.com/Search/Refine.aspx?Keyword=581-TAJB686K006R; RS_PART_NUMBER: 1364515P; RS_PRICE-STOCK: http://uk.rs-online.com/web/p/products/1364515P
D1 = SMAJ5.0A:SMAJ5.0A: Littelfuse SMAJ5.0A, Uni-Directional TVS Diode, 400W, 2-Pin DO-214AC Source: Datasheet <https://www.littelfuse.com/~/media/electronics/datasheets/tvs_diodes/littelfuse_tvs_diode_smaj_datasheet.pdf.pdf>; ALLIED_NUMBER: 70184376; ALLIED_PRICE-STOCK: https://www.alliedelec.com/littelfuse-smaj5-0a/70184376/; DESCRIPTION: Littelfuse SMAJ5.0A, Uni-Directional TVS Diode, 400W, 2-Pin DO-214AC; HEIGHT: 2.29mm; MANUFACTURER_NAME: LITTELFUSE; MANUFACTURER_PART_NUMBER: SMAJ5.0A; MOUSER_PART_NUMBER: 576-SMAJ5.0A; MOUSER_PRICE-STOCK: https://www.mouser.com/Search/Refine.aspx?Keyword=576-SMAJ5.0A; RS_PART_NUMBER: 7645565P; RS_PRICE-STOCK: http://uk.rs-online.com/web/p/products/7645565P
D2 = B120-13-F:B120-13-F: Diode Schottky 20V 1A 2Pin SMA Diodes Inc B120-13-F, SMT Schottky Diode, 20V 1A, 2-Pin DO-214AC Source: Datasheet <https://www.diodes.com/assets/Datasheets/ds13002.pdf>; ALLIED_NUMBER: 70437531; ALLIED_PRICE-STOCK: https://www.alliedelec.com/diodes-inc-b120-13-f/70437531/; DESCRIPTION: Diode Schottky 20V 1A 2Pin SMA Diodes Inc B120-13-F, SMT Schottky Diode, 20V 1A, 2-Pin DO-214AC; HEIGHT: 2.4mm; MANUFACTURER_NAME: Diodes Inc.; MANUFACTURER_PART_NUMBER: B120-13-F; MOUSER_PART_NUMBER: 621-B120-F; MOUSER_PRICE-STOCK: https://www.mouser.com/Search/Refine.aspx?Keyword=621-B120-F; RS_PART_NUMBER: 7513174P; RS_PRICE-STOCK: http://uk.rs-online.com/web/p/products/7513174P
D3-D5 = led:LED: LED OSRAM: - CHIPLED LG R971, LG N971, LY N971, LG Q971, LY Q971, LO R971, LY R971 LH N974, LH R974 LS Q976, LO Q976, LY Q976 LO Q996 - Hyper CHIPLED LW Q18S LB Q993, LB Q99A, LB R99A - SideLED LS A670, LO A670, LY A670, LG A670, LP A670 LB A673, LV A673, LT A673, LW A673 LH A674 LY A675 LS A676, LA A676, LO A676, LY A676, LW A676 LS A679, LY A679, LG A679 - Hyper Micro SIDELED® LS Y876, LA Y876, LO Y876, LY Y876 LT Y87S - SmartLED LW L88C, LW L88S LB L89C, LB L89S, LG L890 LS L89K, LO L89K, LY L89K LS L896, LA L896, LO L896, LY L896 - TOPLED LS T670, LO T670, LY T670, LG T670, LP T670 LSG T670, LSP T670, LSY T670, LOP T670, LYG T670 LG T671, LOG T671, LSG T671 LB T673, LV T673, LT T673, LW T673 LH T674 LS T676, LA T676, LO T676, LY T676, LB T676, LH T676, LSB T676, LW T676 LB T67C, LV T67C, LT T67C, LS T67K, LO T67K, LY T67K, LW E67C LS E67B, LA E67B, LO E67B, LY E67B, LB E67C, LV E67C, LT E67C LW T67C LS T679, LY T679, LG T679 LS T770, LO T770, LY T770, LG T770, LP T770 LB T773, LV T773, LT T773, LW T773 LH T774 LS E675, LA E675, LY E675, LS T675 LS T776, LA T776, LO T776, LY T776, LB T776 LHGB T686 LT T68C, LB T68C - Hyper Mini TOPLED® LB M676 - Mini TOPLED Santana® LG M470 LS M47K, LO M47K, LY M47K Source: http://www.osram.convergy.de LUXEON: - LUMILED® LXK2-PW12-R00, LXK2-PW12-S00, LXK2-PW14-U00, LXK2-PW14-V00 LXK2-PM12-R00, LXK2-PM12-S00, LXK2-PM14-U00 LXK2-PE12-Q00, LXK2-PE12-R00, LXK2-PE12-S00, LXK2-PE14-T00, LXK2-PE14-U00 LXK2-PB12-K00, LXK2-PB12-L00, LXK2-PB12-M00, LXK2-PB14-N00, LXK2-PB14-P00, LXK2-PB14-Q00 LXK2-PR12-L00, LXK2-PR12-M00, LXK2-PR14-Q00, LXK2-PR14-R00 LXK2-PD12-Q00, LXK2-PD12-R00, LXK2-PD12-S00 LXK2-PH12-R00, LXK2-PH12-S00 LXK2-PL12-P00, LXK2-PL12-Q00, LXK2-PL12-R00 Source: www.luxeon.com KINGBRIGHT: KA-3528ASYC Source: www.kingbright.com
IC2 = DRV8302DCAR:DRV8302DCAR: 3-Phase Brushless Motor Pre-Driver with Dual Current Sense Amps and Buck Converter (PWM Ctrl) Source: Datasheet <http://www.ti.com/lit/gpn/drv8302>; DESCRIPTION: 3-Phase Brushless Motor Pre-Driver with Dual Current Sense Amps and Buck Converter (PWM Ctrl); HEIGHT: 1.2mm; MANUFACTURER_NAME: Texas Instruments; MANUFACTURER_PART_NUMBER: DRV8302DCAR; MOUSER_PART_NUMBER: 595-DRV8302DCAR; MOUSER_PRICE-STOCK: https://www.mouser.com/Search/Refine.aspx?Keyword=595-DRV8302DCAR
J3 = B3B-ZR(LF)(SN):B3B-ZR(LF)(SN): B3B-ZR, 1.5mm pitch disconnectable crimp connector, 3-position Source: Datasheet <http://www.jst-mfg.com/product/pdf/eng/eZH.pdf>; DESCRIPTION: B3B-ZR, 1.5mm pitch disconnectable crimp connector, 3-position; HEIGHT: 4.5mm; MANUFACTURER_NAME: JST (JAPAN SOLDERLESS TERMINALS); MANUFACTURER_PART_NUMBER: B3B-ZR(LF)(SN)
JP1-JP3 = SparkFun-Connectors:M02_BOTTOM_ENTRY
JP4 = SRG:JST-PH_6-PIN_HEADER: 5-pin JST PH Shrouded Header, top entry P/N B5B-PH-K-S Mating connector PHR-5 Mating cable assembly: Sparkfun PRT-09917 <http://www.sparkfun.com/products/9917>
L1 = NR6028T220M:NR6028T220M: Fixed Inductors 6028 22uH 175.5mOhms +/-20%Tol 1.3A HiCur Source: Datasheet <http://ds.yuden.co.jp/TYCOMPAS/ut/detail.do?productNo=NR6028T220M&fileName=NR6028T220M_SS&mode=specSheetDownload>; DESCRIPTION: Fixed Inductors 6028 22uH 175.5mOhms +/-20%Tol 1.3A HiCur; HEIGHT: mm; MANUFACTURER_NAME: TAIYO YUDEN; MANUFACTURER_PART_NUMBER: NR6028T220M; MOUSER_PART_NUMBER: 963-NR6028T220M; MOUSER_PRICE-STOCK: https://www.mouser.com/Search/Refine.aspx?Keyword=963-NR6028T220M
M1-M12 = STL260N3LLH6:STL260N3LLH6: None; AVAILABILITY: Good; DESCRIPTION: N-channel 30 V, 0.0011 Ohm typ., 260 A STripFET H6 Power MOSFET in a PowerFLAT 5x6 package; MF: STMicroelectronics; MP: STL260N3LLH6; PACKAGE: PowerVDFN-8 STMicroelectronics; PRICE: 1.48 USD
R1 R2 = CSR2512C0R001F:CSR2512C0R001F: RES 0.001 OHM 1% 3W 2512 Source: Datasheet <https://riedon.com/media/pdf/CSR.pdf>; DESCRIPTION: RES 0.001 OHM 1% 3W 2512; HEIGHT: 0.85mm; MANUFACTURER_NAME: Riedon; MANUFACTURER_PART_NUMBER: CSR2512C0R001F
R3-R11 R16 R21 R22 R24-R29 R31 R33-R37 = rcl:R-US_: RESISTOR, American symbol; SPICEPREFIX: R
R18 R20 R23 R32 R38-R53 = resistor:R-US_: RESISTOR, American symbol
TMP = rcl:R-EU_: RESISTOR, European symbol; SPICEPREFIX: R
U1 = STM32F405RGT6:STM32F405RGT6: High-performance foundation line, ARM Cortex-M4 core with DSP and FPU, 1 Mbyte Flash, 168 MHz CPU, ART Accelerator; AVAILABILITY: Unavailable; DESCRIPTION: High-performance foundation line, ARM Cortex-M4 core with DSP and FPU, 1 Mbyte Flash, 168 MHz CPU, ART Accelerator; MF: STMicroelectronics; MP: STM32F405RGT6; PACKAGE: LQFP-64 STMicroelectronics; PRICE: None
U2 = TC2117-3.3VDBTR:TC2117-3.3VDBTR: Microchip TC2117-3.3VDBTR, LDO Voltage Regulator, 800mA, 3.3 V +/-0.5%, 2.7 6 Vin, 3-Pin SOT-223 Source: Datasheet <https://componentsearchengine.com/Datasheets/2/TC2117-3.3VDBTR.pdf>; DESCRIPTION: Microchip TC2117-3.3VDBTR, LDO Voltage Regulator, 800mA, 3.3 V +/-0.5%, 2.7 6 Vin, 3-Pin SOT-223; HEIGHT: 1.8mm; MANUFACTURER_NAME: Microchip; MANUFACTURER_PART_NUMBER: TC2117-3.3VDBTR; MOUSER_PART_NUMBER: 579-TC2117-3.3VDBTR; MOUSER_PRICE-STOCK: https://www.mouser.com/Search/Refine.aspx?Keyword=579-TC2117-3.3VDBTR; RS_PART_NUMBER: 8234434P; RS_PRICE-STOCK: http://uk.rs-online.com/web/p/products/8234434P
U5 = SN65HVD232DR:SN65HVD232DR: 3.3-V CAN TRANSCEIVERS; AVAILABILITY: Unavailable; DESCRIPTION: CAN 1Mbps 3.3V Industrial 8-Pin SOIC T/R; MF: Texas Instruments; MP: SN65HVD232DR; PACKAGE: SOIC-8 Texas Instruments; PRICE: None
U$1-U$6 = adafruit:FIDUCIAL: For use by pick and place machines to calibrate the vision/machine, 1mm By microbuilder.eu
U$7 U$8 = FOC_JB:M3_POWER_HOLE
Y2 = ABM3B-8.000MHZ-10-1-U-T:ABM3B-8.000MHZ-10-1-U-T: Ceramic SMD Crystal; AVAILABILITY: Unavailable; DESCRIPTION: ABM3B Series 8 MHz ±10 ppm 10 pF -10 to +60 °C Surface Mount Ceramic Crystal; MF: Abracon; MP: ABM3B-8.000MHZ-10-1-U-T; PACKAGE: SMD-4 Abracon; PRICE: None

## Net classes
1 USB: width 0.229 mm, clearance 0.203 mm

## Board
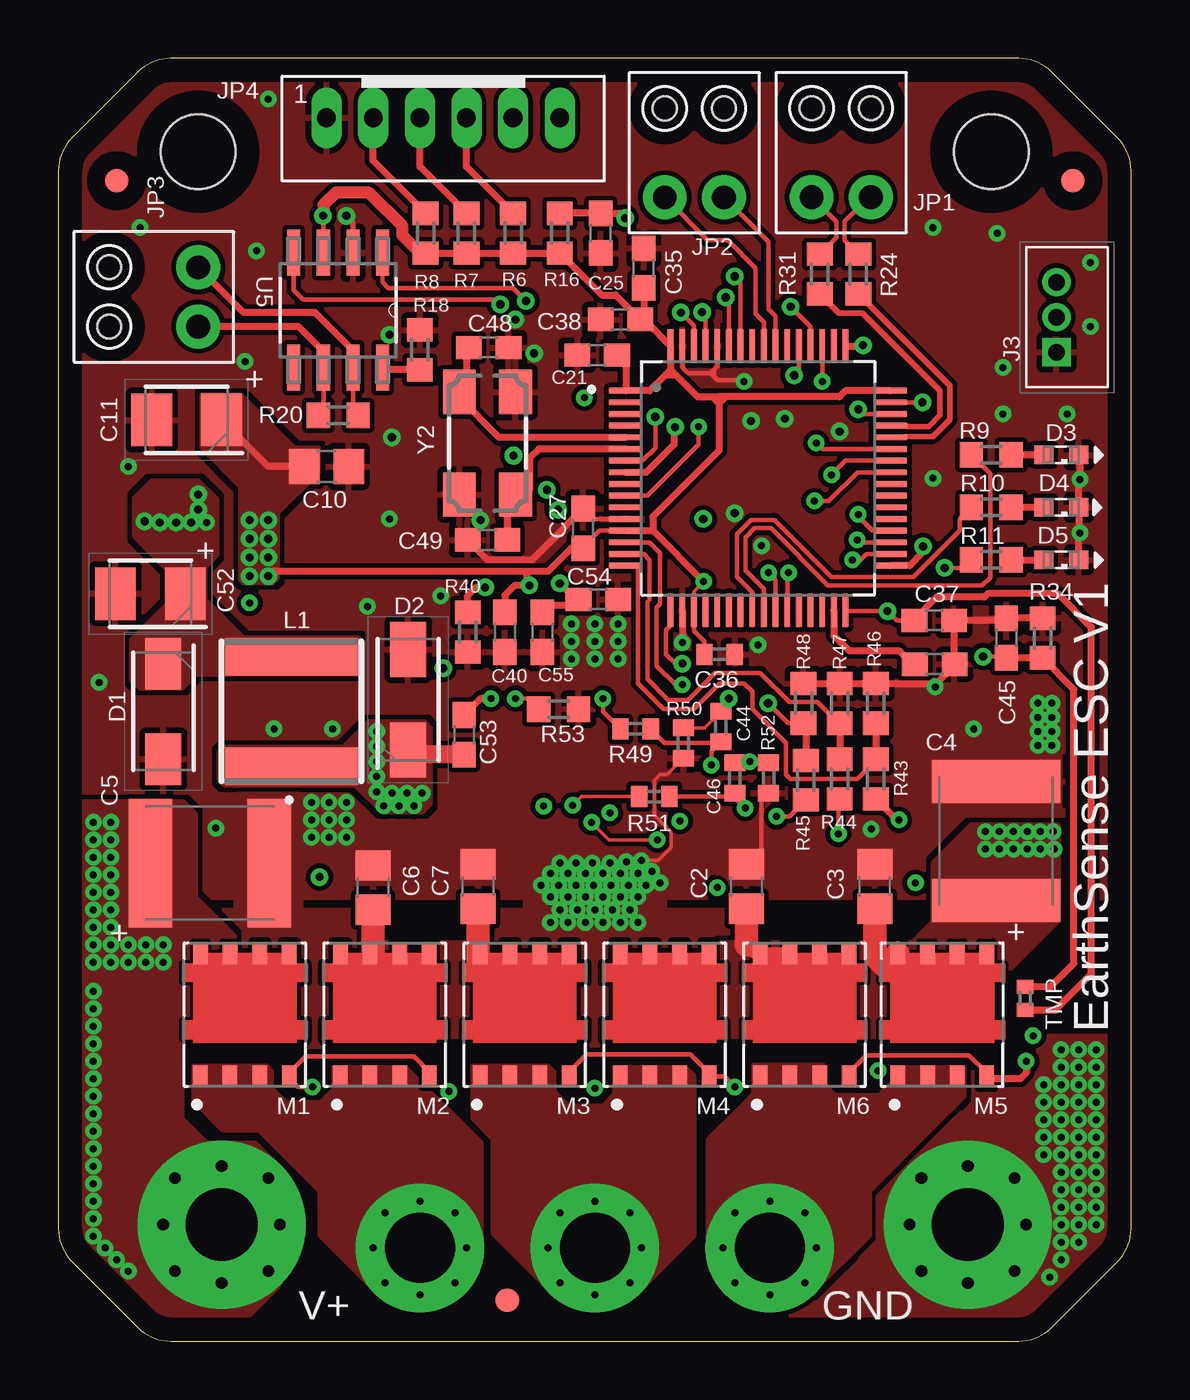
[diagram p6: board, top side]
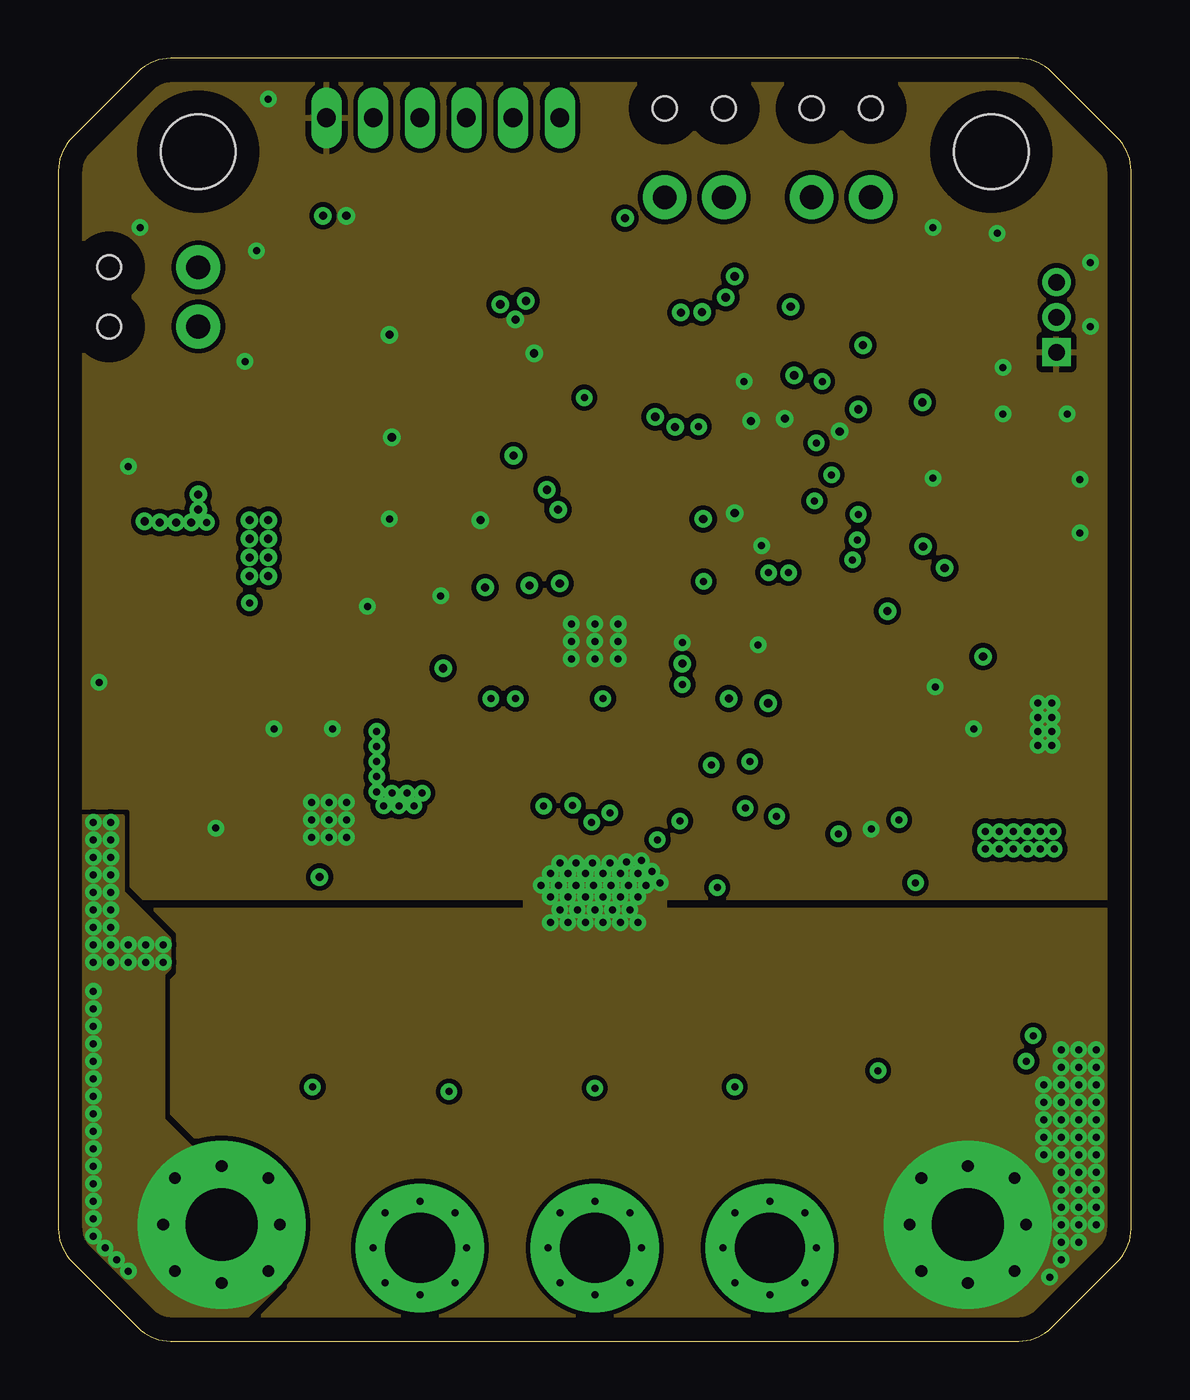
[diagram p7: board, inner layer Route2]
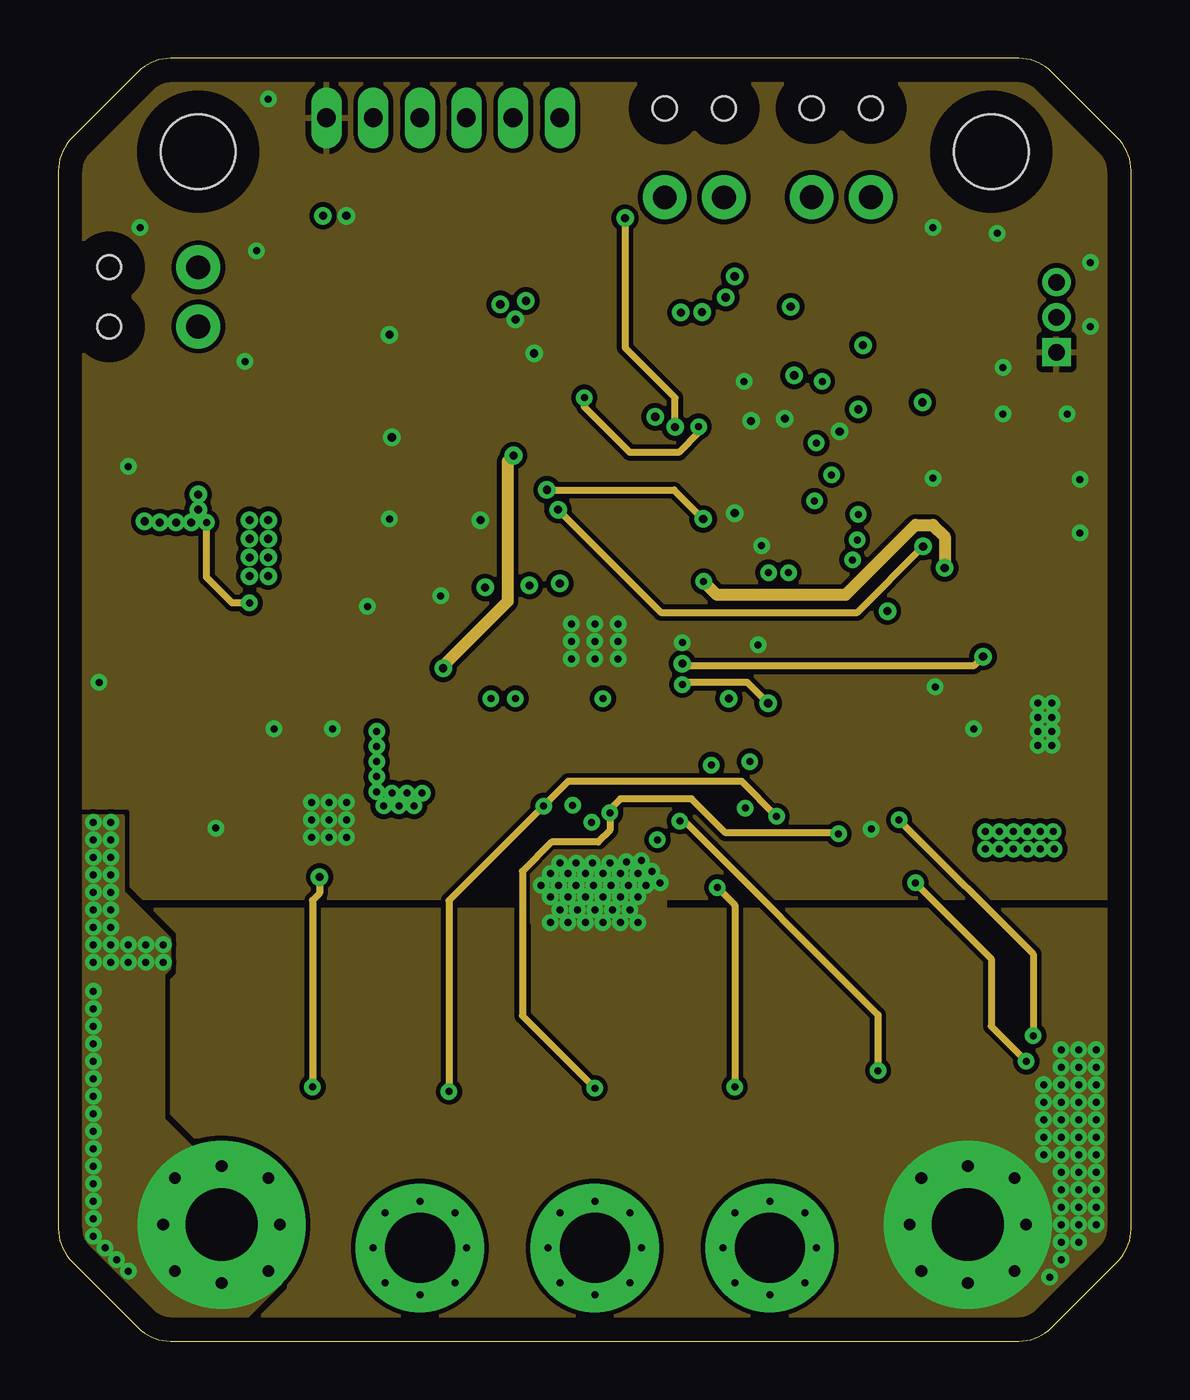
[diagram p8: board, inner layer Route15]
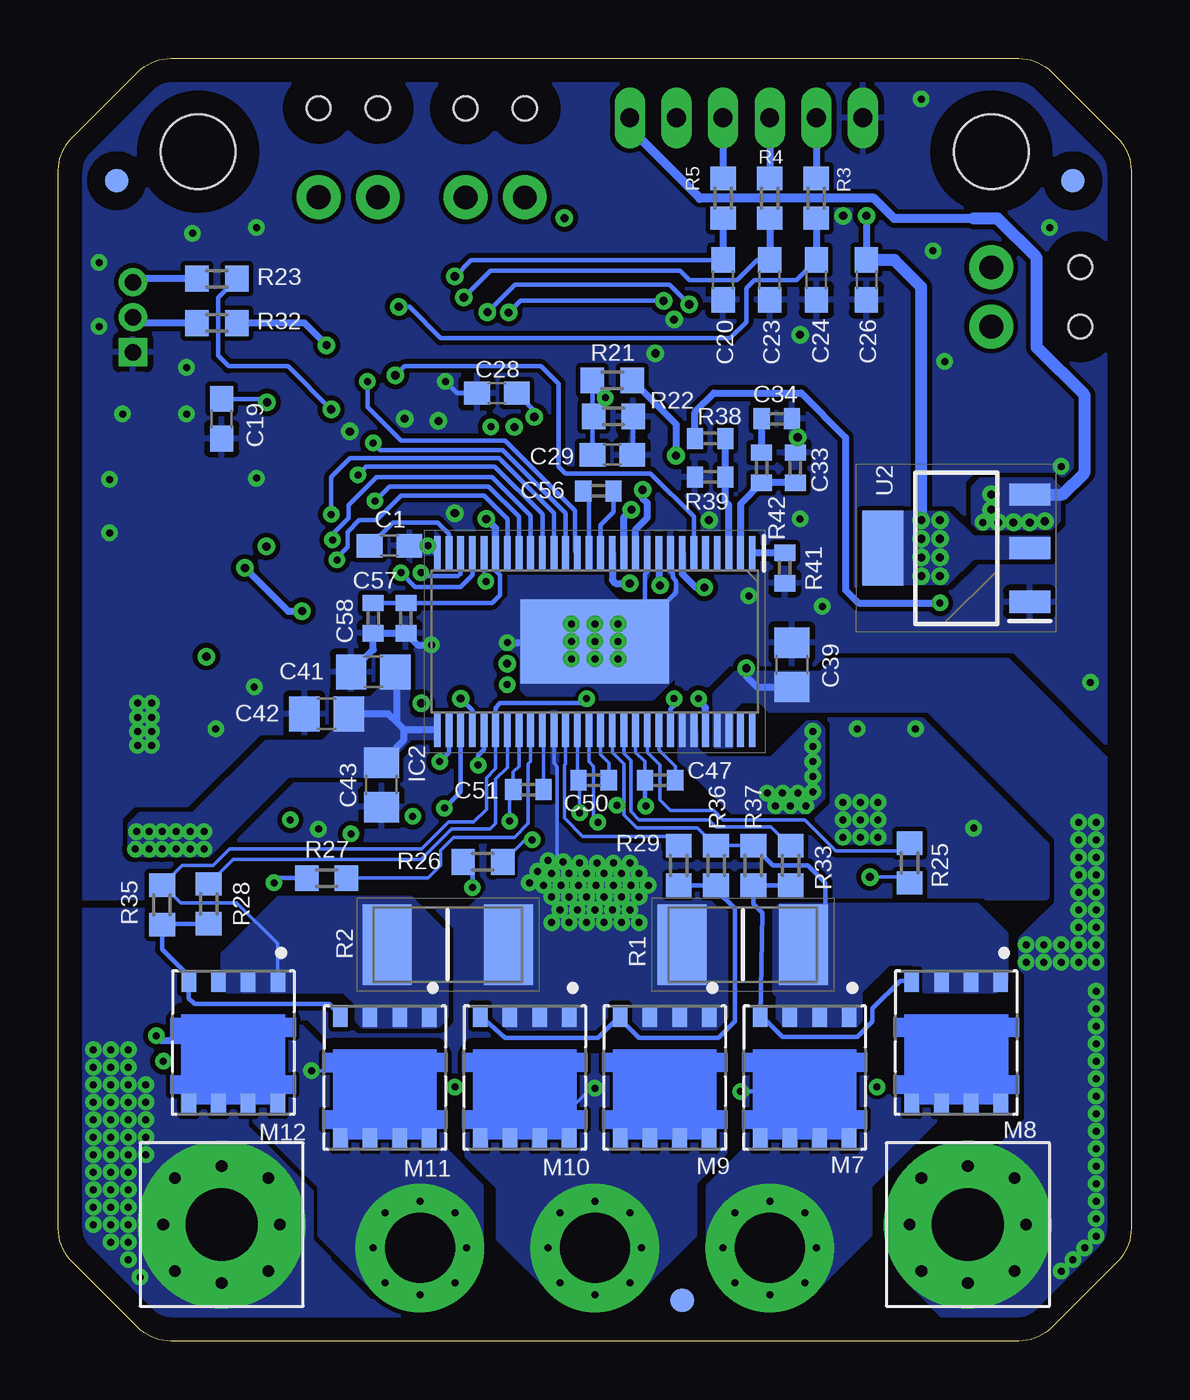
[diagram p9: board, bottom side, seen from below]

Size 46 x 55 mm. Coordinates in mm from the lower left corner, seen from the top.
Outline: 3.41,54.41 0.59,51.59 arc45 0,50.17 0,4.83 arc45 0.59,3.41 3.41,0.59 arc45 4.83,0 41.17,0 arc45 42.59,0.59 45.41,3.41 arc45 46,4.83 46,50.17 arc45 45.41,51.59 42.59,54.41 arc45 41.17,55 4.83,55 arc45 3.41,54.41
Copper layers (1+2*15+16): Top 0.035mm / dielectric 1.5mm / Route2 0.035mm / dielectric 0.15mm / Route15 0.035mm / dielectric 0.2mm / Bottom 0.035mm
Design rules "default *": minimum track width 6mil, minimum drill 0.3mm, track to track 6mil, track to pad 6mil, pad to pad 6mil, via to via 6mil, smd to smd 6mil, copper to edge 40mil, drill to drill 6mil, minimum pad ring 10mil, minimum via ring 8mil, stop-mask expansion 4mil, vias tented up to drill 16mil, thermal gap 10mil
Holes 3.2 mm at 6,51 40,51
tRestrict: 1 lines

### Footprints (pad centres in the part's own frame; a part is rotated, then mirrored left to right if it is on the bottom)
C0603 = smd 1.1 x 1: 1 -0.85,0; 2 0.85,0
C0805 = smd 1.3 x 1.5: 1 -0.95,0; 2 0.95,0
C2220K = smd 1.85 x 5.5: 1 -2.55,0; 2 2.55,0
CAPPM3528X210N = smd 1.75 x 2.25: 1 -1.5,0; 2 1.5,0
C0402 = smd 0.7 x 0.9: 1 -0.65,0; 2 0.65,0
DIOM5026X229N = smd 2.2 x 1.55: 1 -2.05,0; 2 2.05,0
DIOM5226X240N = smd 2.35 x 1.55: 1 -2.15,0; 2 2.15,0
SML0603 = smd 0.8 x 0.8: A 0.75,0; C -0.75,0
SOP50P810X120-57N = smd 1.475 x 0.3: 1 -3.788,6.75; 2 -3.788,6.25; 3 -3.788,5.75; 4 -3.788,5.25; 5 -3.788,4.75; 6 -3.788,4.25; 7 -3.788,3.75; 8 -3.788,3.25; 9 -3.788,2.75; 10 -3.788,2.25; 11 -3.788,1.75; 12 -3.788,1.25; 13 -3.788,0.75; 14 -3.788,0.25; 15 -3.788,-0.25; 16 -3.788,-0.75; 17 -3.788,-1.25; 18 -3.788,-1.75; 19 -3.788,-2.25; 20 -3.788,-2.75; 21 -3.788,-3.25; 22 -3.788,-3.75; 23 -3.788,-4.25; 24 -3.788,-4.75; 25 -3.788,-5.25; 26 -3.788,-5.75; 27 -3.788,-6.25; 28 -3.788,-6.75; 29 3.788,-6.75; 30 3.788,-6.25; 31 3.788,-5.75; 32 3.788,-5.25; 33 3.788,-4.75; 34 3.788,-4.25; 35 3.788,-3.75; 36 3.788,-3.25; 37 3.788,-2.75; 38 3.788,-2.25; 39 3.788,-1.75; 40 3.788,-1.25; 41 3.788,-0.75; 42 3.788,-0.25; 43 3.788,0.25; 44 3.788,0.75; 45 3.788,1.25; 46 3.788,1.75; 47 3.788,2.25; 48 3.788,2.75; 49 3.788,3.25; 50 3.788,3.75; 51 3.788,4.25; 52 3.788,4.75; 53 3.788,5.25; 54 3.788,5.75; 55 3.788,6.25; 56 3.788,6.75 | smd 3.61 x 6.35: 57 0,0
SHDR3W50P0X150_1X3_600X350X450 = drill 0.7 pad 1.1 square: 1 0,0 | drill 0.7 pad 1.1: 2 -1.5,0; 3 -3,0
1X02_BOTTOM_ENTRY = drill 1.016 pad 1.88: 1 0,0; 2 2.54,0 | hole 1.016: 0,3.81; 2.54,3.81
JST_B6B-PH_HEADER = drill 0.8 long: P1 4,0.048; P2 2,0.048; P3 0,0.048; P4 -2,0.048; P5 -4,0.048; P6 -6,0.048
NR6028T220M = smd 1.6 x 5.7: 1 -2.35,0; 2 2.35,0
TRANS_STL60P4LLF6 = smd 0.94 x 0.62: 1 -2.655,1.905; 2 -2.655,0.635; 3 -2.655,-0.635; 4 -2.655,-1.905; 5 2.655,-1.905; 6 2.655,-0.635; 7 2.655,0.635; 8 2.655,1.905
RESC6432X85N = smd 2.1 x 3.45: 1 -2.6,0; 2 2.6,0
R0603 = smd 1 x 1.1: 1 -0.85,0; 2 0.85,0
R0402 = smd 0.7 x 0.9: 1 -0.65,0; 2 0.65,0
R0402' = smd 0.6 x 0.7: 1 -0.5,0; 2 0.5,0
QFP50P1200X1200X160-64N = smd 1.47 x 0.28: 1 -5.67,3.75; 2 -5.67,3.25; 3 -5.67,2.75; 4 -5.67,2.25; 5 -5.67,1.75; 6 -5.67,1.25; 7 -5.67,0.75; 8 -5.67,0.25; 9 -5.67,-0.25; 10 -5.67,-0.75; 11 -5.67,-1.25; 12 -5.67,-1.75; 13 -5.67,-2.25; 14 -5.67,-2.75; 15 -5.67,-3.25; 16 -5.67,-3.75; 33 5.67,-3.75; 34 5.67,-3.25; 35 5.67,-2.75; 36 5.67,-2.25; 37 5.67,-1.75; 38 5.67,-1.25; 39 5.67,-0.75; 40 5.67,-0.25; 41 5.67,0.25; 42 5.67,0.75; 43 5.67,1.25; 44 5.67,1.75; 45 5.67,2.25; 46 5.67,2.75; 47 5.67,3.25; 48 5.67,3.75 | smd 0.28 x 1.47: 17 -3.75,-5.67; 18 -3.25,-5.67; 19 -2.75,-5.67; 20 -2.25,-5.67; 21 -1.75,-5.67; 22 -1.25,-5.67; 23 -0.75,-5.67; 24 -0.25,-5.67; 25 0.25,-5.67; 26 0.75,-5.67; 27 1.25,-5.67; 28 1.75,-5.67; 29 2.25,-5.67; 30 2.75,-5.67; 31 3.25,-5.67; 32 3.75,-5.67; 49 3.75,5.67; 50 3.25,5.67; 51 2.75,5.67; 52 2.25,5.67; 53 1.75,5.67; 54 1.25,5.67; 55 0.75,5.67; 56 0.25,5.67; 57 -0.25,5.67; 58 -0.75,5.67; 59 -1.25,5.67; 60 -1.75,5.67; 61 -2.25,5.67; 62 -2.75,5.67; 63 -3.25,5.67; 64 -3.75,5.67
SOT230P700X180-4N = smd 1.75 x 0.95: 1 -3.15,2.3; 2 -3.15,0; 3 -3.15,-2.3 | smd 1.75 x 3.2: 4 3.15,0
SOIC127P600X175-8N = smd 1.981 x 0.559: 1 -2.464,1.905; 2 -2.464,0.635; 3 -2.464,-0.635; 4 -2.464,-1.905; 5 2.464,-1.905; 6 2.464,-0.635; 7 2.464,0.635; 8 2.464,1.905
FIDUCIAL_1MM = smd 1 x 1: 1 0,0
M3_POWER_HOLE = drill 3.1 pad 7.2: P$1 0,0
OSCCC500X320X110-4N = smd 1.9 x 1.4: 1 -2.2,-1.2; 2 2.2,-1.2; 3 2.2,1.2; 4 -2.2,1.2

### Placement (x,y rotation side)
C1  31.8,34.1 0 bottom
C2  29.5,19.5 90 top
C3  35,19.5 90 top
C4  40.2,21.45 90 top
C5  6.5,20.5 0 top
C6  13.5,19.45 90 top
C7  18,19.5 90 top
C10  11.5,37.5 180 top
C11  5.5,39.5 180 top
C18  37.58,29.02 0 top
C19  39,39.55 270 bottom
C20  17.5,45.5 90 bottom
C21  23.1,42.27 180 top
C23  15.5,45.5 90 bottom
C24  13.5,45.5 90 bottom
C25  23.25,47.5 90 top
C26  11.35,45.5 270 bottom
C27  22.5,34.85 90 top
C28  27.2,40.65 180 bottom
C29  22.25,38 0 bottom
C33  14.4,37.45 270 bottom
C34  15.2,39.55 180 bottom
C35  25.1,46 90 top
C36  28.35,29.45 0 top
C37  37.55,30.9 0 top
C38  24.1,43.8 180 top
C39  14.55,29 90 bottom
C40  19.15,30.4 270 top
C41  32.5,28.7 0 bottom
C42  34.5,26.9 0 bottom
C43  32.15,23.85 90 bottom
C44  28.4,26.35 90 top
C45  40.65,30.15 90 top
C46  29,24.15 90 top
C47  20.2,24.05 180 bottom
C48  18.45,42.6 0 top
C49  18.4,34.35 180 top
C50  23.05,24.05 180 bottom
C51  25.85,23.65 180 bottom
C52  3.95,32.05 180 top
C53  17.4,26 270 top
C54  23.15,31.8 0 top
C55  20.75,30.4 270 top
C56  22.85,36.45 0 bottom
C57  31.1,31 270 bottom
C58  32.5,31 270 bottom
D1  4.5,27 270 top
D2  15,27.5 90 top
D3  43,38 180 top
D4  43,35.75 180 top
D5  43,33.5 180 top
IC2  23,30 270 bottom
J3  42.8,42.4 270 top
JP1  32.3,49.05 0 top
JP2  26,49.04 0 top
JP3  6,43.5 90 top
JP4  15.5,52.5 180 top
L1  10,27 90 top
M1  8,14 90 top
M2  14,14 90 top
M3  20,14 90 top
M4  26,14 90 top
M5  37.9,14 90 top
M6  32,14 90 top
M7  14,11.3 270 bottom
M8  7.5,12.8 270 bottom
M9  20,11.3 270 bottom
M10  26,11.3 270 bottom
M11  32,11.3 270 bottom
M12  38.5,12.8 270 bottom
R1  16.66,17 0 bottom
R2  29.3,17 180 bottom
R3  13.5,49 90 bottom
R4  15.5,49 90 bottom
R5  17.5,49 90 bottom
R6  19.5,47.5 90 top
R7  17.5,47.5 90 top
R8  15.75,47.5 90 top
R9  40,38 0 top
R10  40,35.75 0 top
R11  40,33.5 0 top
R16  21.5,47.5 90 top
R18  15.5,42.5 270 top
R20  12,39.7 180 top
R21  22.25,41.2 180 bottom
R22  22.2,39.65 0 bottom
R23  39.2,45.55 0 bottom
R24  34.3,45.75 270 top
R25  9.5,20.5 90 bottom
R26  27.8,20.55 0 bottom
R27  34.5,19.85 0 bottom
R28  39.55,18.75 90 bottom
R29  19.4,20.4 90 bottom
R31  32.65,45.75 270 top
R32  39.2,43.65 0 bottom
R33  14.6,20.4 90 bottom
R34  42.2,30.15 270 top
R35  41.55,18.7 90 bottom
R36  17.8,20.4 90 bottom
R37  16.2,20.4 90 bottom
R38  18.05,38.7 180 bottom
R39  18.05,37.05 0 bottom
R40  17.55,30.4 270 top
R41  14.85,33.15 270 bottom
R42  15.85,37.45 90 bottom
R43  35.05,24.1 270 top
R44  33.5,24.1 270 top
R45  32.05,24.05 270 top
R46  35.05,27.35 90 top
R47  33.5,27.35 90 top
R48  31.95,27.35 90 top
R49  24.75,26.25 180 top
R50  26.8,25.65 270 top
R51  25.55,23.35 180 top
R52  30.45,24.15 270 top
R53  21.45,27.1 0 top
TMP  NTC_10K  [R0402']  41.45,14.7 270 top
U1  30,37 0 top
U2  7.5,34 180 bottom
U5  12,44.2 270 top
U$1  19.25,1.75 0 top
U$2  43.5,49.75 0 bottom
U$3  2.5,49.75 0 top
U$4  43.5,49.75 0 top
U$5  2.5,49.75 0 bottom
U$6  19.25,1.75 0 bottom
U$7  7,5 0 top
U$8  39,5 0 top
Y2  18.4,38.5 90 top

### Tracks (layer width: path | path; a pad name or v marks a point on that pad's centre or on a via)
5V  (via drill 0.3, 0.35)
  Route15 0.305: v8.2,31.65 7.45,31.65 6.35,32.75 v6.35,35.1
  Bottom 0.305: R38.2 18.7,39.85 17.9,40.65 14.15,40.65 12.25,38.75 12.25,32.2 11.7,31.65 v8.2,31.65
  Bottom 0.381: 6.75,48.13 10.16,48.13 11.03,49 18.5,49 21.5,52 JP4.P6
  Bottom 0.508: U2.3 2.95,36.3 2,37.25 2,40.55 4.05,42.6 4.05,46.45 5.73,48.13 6.75,48.13
  other vias: 3.7,35.15 4.35,35.1 5.05,35.1 5.7,35.1 6,35.65 6,36.3
  pour Top (no thermals): 5.5,32.4 5.65,32.4 7.9,30.15 12.85,30.15 12.85,28.6 5.9,28.6 5.3,28 3.5,28 3.15,28.35 3.15,30.05
  pour Top (no thermals): 4.95,31.55 4.65,31.85 4.65,33.1 3.25,34.5 3.25,36.15 4,36.9 6,36.9 6.8,36.1 6.8,33.7 6.3,33.2 6.3,31.75 6.1,31.55
  pour Bottom (no thermals): 3.45,36.95 6.45,36.95 6.8,36.6 6.8,35.1 6.55,34.85 3.45,34.85 3.1,35.2 3.1,36.6
ADC_TEMP  (via drill 0.35 pad 0.6)
  Top 0.203: U1.17 26.25,30.68 26.05,30.48 26.05,29.45 26.45,29.05 v26.76,29.05 | v39.65,29.35 40.6,29.35 C45.1
  Top 0.305: TMP.1 42.55,15.2 43.55,16.2 43.55,27.95 R34.2 C45.1
  Route15 0.305: v39.65,29.35 39.25,28.95 26.76,28.95 v26.76,29.05
BR_SO1  (via drill 0.3)
  Top 0.203: v31.31,32.95 31.31,32.71 31.25,32.65 U1.27
  Bottom 0.203: IC2.25 28.25,32.85 28.76,32.34 30.7,32.34 v31.31,32.95
BR_SO2  (via drill 0.3)
  Top 0.203: v30.45,32.95 30.75,32.65 U1.26
  Bottom 0.203: IC2.26 28.75,32.9 28.85,32.8 30.3,32.8 v30.45,32.95
CAN_RX  (via drill 0.35)
  Top 0.203: U5.4 10.1,45.05 10.5,44.65 18.75,44.65 v18.95,44.45 | v27.6,44.12 27.75,43.97 U1.61
  Bottom 0.203: v18.95,44.45 19.8,45.3 26.42,45.3 v27.6,44.12
CAN_TX  (via drill 0.35)
  Top 0.203: U5.1 13.9,45.39 14.15,45.15 19.5,45.15 v20.05,44.6 | v26.69,44.1 27.25,43.54 U1.62
  Bottom 0.203: v20.05,44.6 26.19,44.6 v26.69,44.1
CANH
  Top 0.203: U5.7 12.63,39.91 R20.1
  Top 0.305: U5.7 12.63,42.47 11,44.1 7.94,44.1 JP3.2
CANL
  Top 0.203: U5.6 11.37,39.91 R20.2
  Top 0.305: U5.6 11.37,42.44 10.3,43.5 JP3.1
DC_CAL  (via drill 0.35, 0.35 pad 0.6)
  Top 0.305: v37.08,34.07 37.08,33.83 36.5,33.25 U1.33
  Route15 0.305: v37.08,34.07 34.26,31.25 25.83,31.25 v21.43,35.65
  Bottom 0.305: IC2.12 21.75,35.33 v21.43,35.65
EN_GATE  (via drill 0.3)
  Top 0.203: v32.75,41.15 U1.51
  Bottom 0.203: IC2.16 23.85,33.88 23.85,35.6 26.84,38.6 31.3,38.6 32.75,40.05 v32.75,41.15
FAULT  (via drill 0.35)
  Top 0.203: v31.55,41.4 31.75,41.6 U1.53
  Bottom 0.203: IC2.6 18.75,35.35 20.6,37.2 24.25,37.2 24.55,37.5 24.55,41.05 25.3,41.8 31.15,41.8 v31.55,41.4
GND  (via drill 0.3, 0.35, 0.35 pad 0.6, 0.5)
  Top 0.152: R50.2 26.1,24.3 25.8,24.3 25.55,24.05 25.55,22.55 26.26,21.84 26.26,21.16 25.7,20.6 v25,20.6
  Top 0.203: U1.12 22.95,35.25 C27.2 | U5.2 12.63,47.97 v12.35,48.25 | U1.63 26.75,41.75 27,41.5 27.95,41.5 | U1.60 28.25,41.8 28.1,41.65 | 27.95,41.5 28.1,41.65 | R52.2 30.15,23.2 30.15,21.1 C2.2 | v29.4,41.15 29.35,41.2 28.25,41.2 28.1,41.35 | 28.1,41.35 27.95,41.5 | 28.1,41.35 28.1,41.65
  Top 0.305: U1.18 v26.75,29.95 | R48.2 R47.2 R46.2 37.45,28.2 v37.6,28.05 37.6,28.15 38.42,28.98 C18.2 38.4,29.05 C37.2 40.55,30.9 C45.2 R34.1 | D3.C 43.8,37.95 v43.8,36.95 43.75,36.9 D4.C 43.75,34.7 | 43.75,34.7 v43.8,34.65 | D5.C 43.75,34.7 | C27.2 20.3,33.5 18.4,33.5 C49.2
  Bottom 0.152: IC2.39 24.75,24.8 24.61,24.65 24.61,20.55 v24.1,20.05
  Bottom 0.203: C1.2 v30.15,34.1 29.84,33.79 IC2.28 | IC2.8 19.75,32.99 19.66,32.9 19.66,32.73 19.51,32.59 19.51,32.09 21.6,30 22.5,30 | 22.5,30 IC2.57 | IC2.10 20.75,32.99 20.85,32.89 20.85,31.65 22.5,30 | C28.2 28.9,40.65 v29.4,41.15 | R22.2 21.35,38.05 C29.2
  Bottom 0.305: v26.75,29.95 24.05,29.95 v24,30 | v30,29.85 30.6,29.85 C57.2 C58.2 32.5,29.65 C41.1
  other vias: 21.1,19.05 21.85,19.05 22.6,19.05 23.35,19.05 24.1,19.05 24.85,19.05 39,7.5 39,2.5 36.5,5 41.5,5 41,7 37,7 37,3 41,3 23,30 22,30 22,30.75 23,30.75 24,30.75 24,29.25 23,29.25 22,29.25 21.1,20.05 21.85,20.05 22.6,20.05 23.35,20.05 24.85,20.05 10.85,23.1 11.6,23.1 12.35,23.1 10.85,22.35 11.6,22.35 12.35,22.35 10.85,21.6 11.6,21.6 12.35,21.6 42.6,26.75 42.6,26.15 42,26.75 42,26.15 42,27.35 42.6,27.35 42,25.55 42.6,25.55 21.45,19.55 22.2,19.55 22.95,19.55 23.7,19.55 24.45,19.55 20.7,19.55 25.2,19.55 21.5,18.5 22.25,18.5 23,18.5 23.75,18.5 24.5,18.5 21.1,17.95 21.85,17.95 22.6,17.95 23.35,17.95 24.1,17.95 24.85,17.95 19.6,43.8 14.2,43.15 20.4,42.35 18.1,35.2 14.3,38.75 29.7,39.45 31.15,39.55 33.5,39 29,35.5 34.85,21.95 42.25,10.25 43,10.25 43.75,10.25 44.5,10.25 44.5,9.5 43.75,9.5 43,9.5 42.25,9.5 42.25,8.75 43,8.75 43.75,8.75 44.5,8.75 44.5,8 43.75,8 43,8 42.25,8 43,7.25 43.75,7.25 44.5,7.25 44.5,6.5 43.75,6.5 43,6.5 43.75,5.75 44.5,5.75 43.75,5 44.5,5 43.75,4.25 43,5.75 43,5 43,4.25 43,3.5 42.5,2.75 42.25,11 43,11 43.75,11 44.5,11 44.5,11.75 43.75,11.75 43,11.75 43,12.5 43.75,12.5 44.5,12.5 37.5,47.75 44.25,43.5 44.25,46.25 40.25,47.5 40.5,41.75 43.25,39.75 40.5,39.75 37.5,37 14.2,35.25 13.25,31.5 16.4,31.95 6.75,22 9.25,26.25 11.75,26.25 1.75,28.25 39.25,26.25 9,53.25 3.5,47.75 8,42 8.5,46.75 3,37.5 21.5,20.5 22.2,20.5 22.9,20.5 23.65,20.5 24.35,20.55 25.45,20.15 25.8,19.65
  pour Top (isolate 0.203, rank 2): -0.5,63 48,63 48,19 -0.5,19
  pour Bottom (isolate 0.203, rank 2): -1,63.5 47,63.5 47,19 -1,19
  pour Route2 (isolate 0.203, rank 2): -2,63.5 48,63.5 48,19 -2,19
  pour Route15 (isolate 0.203, rank 2): -2,64 48,64 48,19 -2,19
  pour Top (rank 2, no thermals): 42.9,22.6 36.95,22.6 36.95,25.3 37.05,25.4 42.85,25.4 42.95,25.3 42.95,22.65
  pour Top (rank 2, no thermals): 10.4,23.4 10.4,17.45 8.2,17.45 7.6,18.05 7.6,23.35 7.7,23.45 10.35,23.45
  pour Top (no thermals): 12.25,21.3 12.25,19.95 12.6,19.6 14.3,19.6 14.65,19.95 14.65,21.25 14.45,21.45 12.4,21.45
  pour Top (no thermals): 16.75,21.3 16.75,19.95 17.1,19.6 18.8,19.6 19.15,19.95 19.15,21.25 18.95,21.45 16.9,21.45
  pour Top (no thermals): 28.25,21.3 28.25,19.95 28.6,19.6 30.3,19.6 30.65,19.95 30.65,21.25 30.45,21.45 28.4,21.45
  pour Top (no thermals): 33.75,21.3 33.75,19.95 34.1,19.6 35.8,19.6 36.15,19.95 36.15,21.25 35.95,21.45 33.9,21.45
  pour Bottom (no thermals): 17.8,13.5 20.8,13.5 21.25,13.95 21.25,14.45 21.6,14.8 22.25,14.8 22.6,14.45 22.6,13.9 22.95,13.55 26.75,13.55 27.15,13.95 27.15,14.5 28.45,15.8 28.45,18.45 25.75,21.15 20.4,21.15 17.5,18.25 17.5,13.8
  pour Top (rank 2, no thermals): 37.5,9.8 34.4,6.7 34.4,2.85 37.4,-0.15 41.95,-0.15 46.1,4 46.1,9.15 45.45,9.8
  pour Bottom (rank 2, no thermals): 37.45,9.8 34.4,6.75 34.4,2.85 37.4,-0.15 41.95,-0.15 46.1,4 46.1,8.9 45.2,9.8
  pour Route15 (rank 2, no thermals): 37.4,9.8 34.5,6.9 34.5,2.75 37.4,-0.15 41.95,-0.15 46.1,4 46.1,8.6 44.9,9.8
  pour Route2 (rank 2, no thermals): 37.45,9.8 34.45,6.8 34.45,2.8 37.4,-0.15 41.95,-0.15 46.1,4 46.1,8.3 44.6,9.8
  pour Bottom (no thermals): 20.6,31.7 19.45,31.7 18.95,31.2 18.95,29.2 20.55,27.6 25.7,27.6 26.05,27.95 26.05,29.1 26.85,29.9 26.85,31.65 26.15,32.35 22.7,32.35 21.9,31.55 20.75,31.55
  pour Bottom (isolate 0.203, rank 2, no thermals): -3.5,18.5 47.25,18.5 47.25,-1 -3.5,-1
  pour Top (isolate 0.203, rank 2, no thermals): -2.5,18.5 47.5,18.5 47.5,-1 -2.5,-1
  pour Route2 (isolate 0.203, rank 2, no thermals): -2,18.5 48,18.5 48,-1 -2,-1
  pour Route15 (isolate 0.203, rank 2, no thermals): -1,18.5 49,18.5 49,-1 -1,-1
  pour Route15 (no thermals): 22.75,21 21,21 20,20 20,18.25 20.75,17.5 25.25,17.5 26,18.25 26,19.75 24.75,21
  pour Top (no thermals): 24.75,21 20.35,21 20,20.65 20,18.25 20.75,17.5 25.25,17.5 26,18.25 26,19.75
  pour Bottom (no thermals): 24.75,21 20.6,21 20,20.4 20,18.25 20.75,17.5 25.25,17.5 26,18.25 26,19.75
  pour Route2 (no thermals): 24.75,21 20.8,21 20,20.2 20,18.25 20.75,17.5 25.25,17.5 26,18.25 26,19.75
H1  (via drill 0.3)
  Top 0.203: U1.43 32.76,38.25 v32.5,38.51
  Bottom 0.203: v32.5,38.51 32.2,38.21 26.95,38.21 24.25,35.5 IC2.17
H1_LOW  (via drill 0.3)
  Top 0.152: v22.06,22.97 22.44,23.35 R51.2
  Bottom 0.152: IC2.44 22.25,25.25 21.75,24.75 21.75,23 | 21.75,23 21.75,22.55 21.2,22 18.6,22 18.24,21.64 18.19,21.64 R36.2 R37.2 | 21.75,23 22.03,23 v22.06,22.97
  Bottom 0.203: R37.2 15.35,20.4 13.85,20.4 13.1,19.65 13.1,17.95 R1.2
  pour Bottom (no thermals): 5.8,15 5.35,15.45 5.35,17.45 6.6,18.7 15.05,18.7 15.3,18.45 15.3,14.95 15.15,14.8 15.15,13.85 14.85,13.55 11.8,13.55 11.6,13.75 11.6,15 10.4,16.2 9.35,16.2 9.15,16 9.15,15.25 8.9,15
H2  (via drill 0.3)
  Top 0.203: U1.42 33.75,37.75 v33.15,37.15 v33.15,37.14
  Bottom 0.203: v33.15,37.14 32.8,37.49 27.29,37.49 25.25,35.45 IC2.19
H3  (via drill 0.3)
  Top 0.203: U1.41 34.25,37.25 33.02,36.02 v32.42,36.02
  Bottom 0.203: v32.42,36.02 31.79,36.65 27.55,36.65 26.25,35.35 IC2.21
H3_LOW  (via drill 0.3)
  Top 0.203: R49.2 23.35,27 v23.35,27.55
  Bottom 0.152: IC2.34 27.25,26.1 27.25,24.55 27.65,24.15 27.65,22.8 28.2,22.25 29.28,22.25 30.43,21.1 38.65,21.1 39.35,20.4 40.7,20.4 R35.2 41.5,19.55 40.75,18.8 38.35,18.8 36.59,17.05 M12.1
  Bottom 0.203: v23.35,27.55 23.55,27.35 27.05,27.35 27.25,27.15 27.25,26.1
  pour Bottom (no thermals): 29.8,13.5 32.95,13.5 33.1,13.65 33.2,13.75 33.2,14.45 33.75,15 36.2,15 38.75,15 38.95,15.2 38.95,16.6 38.75,16.8 36.55,19 30.9,19 29.35,17.45 29.35,14.2 29.35,13.9 29.7,13.55
HALL1_IN
  Top 0.305: R6.2 17.5,50.35 JP4.P4
  Bottom 0.305: JP4.P4 R5.2
HALL2_IN
  Top 0.305: R7.2 15.5,50.35 JP4.P3
  Bottom 0.305: JP4.P3 R4.2
HALL3_IN
  Top 0.305: R8.2 13.5,50.6 JP4.P2
  Bottom 0.305: JP4.P2 R3.2
HALL_1  (via drill 0.35)
  Top 0.203: v29,45.65 29.25,45.4 U1.58
  Bottom 0.203: C20.2 28.3,46.35 v29,45.65
  Bottom 0.305: R5.1 C20.2
HALL_2  (via drill 0.35)
  Top 0.203: v28.62,44.75 28.75,44.61 U1.59
  Bottom 0.203: C23.2 16.05,46.35 16.9,45.5 18.95,45.5 19.35,45.9 27.46,45.9 v28.62,44.75
  Bottom 0.305: R4.1 C23.2
HALL_3  (via drill 0.35)
  Top 0.203: v31.4,44.35 32.25,43.5 U1.52
  Bottom 0.203: C24.2 14.35,45.5 16.15,45.5 16.5,45.15 16.5,43.7 17.2,43 29.6,43 30.95,44.35 v31.4,44.35
  Bottom 0.305: R3.1 C24.2
ID0
  Top 0.203: U1.56 30.25,43.7 29.9,44.05 29.9,46 28.7,47.2 27.84,47.2 JP2.1
ID1
  Top 0.203: U1.55 30.75,43.95 30.45,44.25 30.45,47.13 JP2.2
L1  (via drill 0.3)
  Top 0.203: U1.36 34.9,34.75 34.3,35.35 v34.3,35.45
  Bottom 0.203: v34.3,35.45 34.3,37.05 33.5,37.85 27.1,37.85 24.75,35.5 IC2.18
L2  (via drill 0.3)
  Top 0.203: v34.25,34.35 34.25,34.25 U1.35
  Bottom 0.203: v34.25,34.35 34.25,34.6 33.55,35.3 33.55,35.85 32.35,37.05 27.4,37.05 25.75,35.4 IC2.20
L3  (via drill 0.3)
  Top 0.203: U1.34 34.65,33.75 34.4,33.5 v34.05,33.5
  Bottom 0.203: IC2.22 26.75,35.25 27.75,36.25 31.3,36.25 32.35,35.2 33.1,35.2 33.6,34.7 33.6,34.05 34.05,33.6 v34.05,33.5
LED_GREEN
  Top 0.203: U1.24 29.75,32.1 29.09,32.76 29.09,34.6 29.7,35.21 30.7,35.21 33.15,32.76 36.66,32.76 38.65,34.75 38.65,35.25 R10.1
LED_RED
  Top 0.203: U1.25 30.25,32.25 29.45,33.05 29.45,34.45 29.85,34.85 30.55,34.85 33,32.4 39.6,32.4 39.95,32.75 39.95,37.2 R9.1
M_H1
  Bottom 0.152: IC2.47 20.75,25.25 20.2,24.7 20.2,23.2 19.75,22.75 17.9,22.75 17.5,22.35 14,22.35 12.67,21.02 9.83,21.02 R25.2
M_H2  (via drill 0.3)
  Top 0.152: v25.68,21.5 23.62,21.5 v22.87,22.25
  Bottom 0.152: IC2.42 23.25,24.85 23.05,24.65 23.05,22.43 v22.87,22.25 | R26.2 26.93,20.55 25.98,21.5 v25.68,21.5
M_H3
  Bottom 0.152: IC2.37 25.75,24.85 25.85,24.75 25.85,22.2 26.45,21.6 29.05,21.6 29.6,21.05 29.6,20.4 30.15,19.85 R27.2
M_L1
  Bottom 0.152: IC2.45 21.75,25.2 21.45,24.9 21.45,22.7 21.1,22.35 18.1,22.35 17.8,22.05 15.45,22.05 14.65,21.25 R33.2
M_L2
  Bottom 0.152: IC2.40 24.25,24.75 24.3,24.7 24.3,22.43 23.52,21.65 19.8,21.65 R29.2
M_L3
  Bottom 0.152: IC2.35 26.75,24.6 27.25,24.1 27.25,22.2 27.5,21.95 29.15,21.95 30.45,20.65 38.5,20.65 R28.2
N$1  (via drill 0.35 pad 0.6)
  Top 0.203: U1.7 25.05,37.75 25.6,38.3 v25.6,39.63
  Bottom 0.203: v25.6,39.63 25.6,39.9 C28.1
N$2  (via drill 0.35 pad 0.6)
  Route15 0.305: v20.95,36.5 26.4,36.5 v27.65,35.25
  Bottom 0.203: C58.1 C57.1 27.4,31.65 27.05,32 27.05,32.84 27.25,33.04 IC2.23
  Bottom 0.305: IC2.23 27.25,34.85 v27.65,35.25 | IC2.11 21.25,34.8 20.75,35.3 20.75,35.93 20.95,36.13 v20.95,36.5
N$3
  Top 0.305: R18.2 13.99,41.65 U5.8
N$4
  Bottom 0.305: R32.1 42.55,43.65 J3.2
N$5  (via drill 0.3, 0.35)
  Top 0.203: v10.9,10.9 10.25,10.9 9.9,11.25 M1.4 9.9,11.51 10.6,12.2 15.25,12.2 15.91,11.54 M2.4
  Route15 0.305: v11.2,19.9 11.2,19.2 10.9,18.9 v10.9,10.9
  Bottom 0.152: R25.1 9.75,19.9 v11.2,19.9
N$9
  Bottom 0.305: IC2.3 17.25,35.85 17.4,36 R39.2 R38.1
N$10  (via drill 0.35 pad 0.6)
  Top 0.305: v18.3,32.32 17.9,32.32 17.55,31.97 R40.1
  Bottom 0.305: IC2.7 19.25,32.9 18.67,32.32 v18.3,32.32
N$11  (via drill 0.3)
  Top 0.203: U1.10 25.25,36.25 27.45,38.45 v27.45,39.21
  Route15 0.305: v27.45,39.21 27.45,38.95 26.6,38.1 24.5,38.1 22.55,40.05 v22.55,40.45
  Bottom 0.203: R21.2 23.1,40.75 23.1,39.7 R22.1 23.1,39.6 C29.1
  Bottom 0.305: v22.55,40.45 22.85,40.75 23.1,40.75
N$12
  Top 0.203: R24.1 33.71,47.19 33.71,48 34.76,49.05 JP1.2
N$13  (via drill 0.35 pad 0.6)
  Top 0.305: C55.1 20.75,31.4 20.9,31.55 22.05,31.55 C54.1 22.19,31.8 v21.5,32.49
  Bottom 0.305: IC2.13 22.25,32.63 22.1,32.49 v21.5,32.49
N$14
  Bottom 0.203: IC2.14 22.75,35 22.2,35.55 C56.2
N$15
  Top 0.305: U1.31 33.25,30.25 33.9,29.6 36.05,29.6 36.62,29.02 C18.1
N$16
  Bottom 0.203: C56.1 23.25,36.2 IC2.15
N$18
  Bottom 0.203: M11.4 34.4,14.45 40.15,14.45 40.41,14.71 M12.4 40.41,15.65 41.55,16.8 R35.1 41.5,17.9 R28.1
N$19
  Top 0.203: R31.1 33.35,47.3 33.35,48 JP1.1
N$20
  Bottom 0.305: R41.1 16.24,33.8 IC2.1
N$21  (via drill 0.35)
  Top 0.203: U1.47 v37.05,40.25
  Bottom 0.203: v37.05,40.25 37.2,40.4 C19.1
N$22
  Top 0.305: U1.6 20.6,38.25 20.2,37.85 20.2,36.5 19.25,35.55 C49.1 19.25,35.95 Y2.1
N$23
  Top 0.305: U1.5 18.9,38.75 17.2,40.45 Y2.3 17.2,40.95 17.5,41.25 17.5,42.5 C48.1
N$25
  Bottom 0.203: R33.1 R37.1 16.2,18.75 15.8,18.36 M7.4 15.8,13.9 14.95,13.05 11.75,13.05 11.1,13.7 11.1,14.26 9.9,15.46 M8.4
N$26
  Bottom 0.305: R23.1 42.65,45.55 J3.3
N$28  (via drill 0.3)
  Top 0.203: M3.4 21.91,11.55 22.65,12.3 27.1,12.3 27.91,11.5 M4.4 28.55,11.34 v29,10.9
  Route15 0.305: v28.25,19.45 29,18.7 v29,10.9
  Bottom 0.203: R26.1 28.48,20.38 28.25,20.2 28.25,20.19 v28.25,19.45
N$29
  Bottom 0.203: M9.4 21.98,13.88 | 21.98,13.88 22.86,13 26.85,13 M10.4 | 21.98,13.88 21.1,13 17.7,13 17,13.7 17,18.55 17.8,19.35 R36.1 R29.1
N$35  (via drill 0.3)
  Top 0.203: M6.4 33.91,11.51 34.65,12.25 39.05,12.25 39.8,11.5 M5.4
  Top 0.305: v41.5,12 41.5,11.5 41.25,11.25 39.9,11.25 M5.4
  Route15 0.305: v36.75,19.65 40,16.4 40,13.5 v41.5,12
  Bottom 0.203: R27.1 36.55,19.85 v36.75,19.65
N$39
  Bottom 0.305: C33.2 R42.1 16.75,35.9 IC2.2
N$40
  Bottom 0.305: C34.2 R42.2
N$42
  Bottom 0.203: IC2.27 29.25,34.6 29.75,35.1 31.65,35.1 C1.1
N$45  (via drill 0.3)
  Top 0.203: R53.1 20.55,27.1 20.1,27.55 v19.6,27.55
  Bottom 0.203: IC2.49 19.75,27.11 19.6,27.26 v19.6,27.55
N$49  (via drill 0.3 pad 0.6)
  Top 0.203: R52.1 29.7,24.8 v29.65,24.85 29.05,24.85 C46.2
  Bottom 0.203: IC2.30 29.25,25.25 v29.65,24.85
N$50  (via drill 0.3 pad 0.6)
  Top 0.203: R51.1 28.85,23.35 C46.1 29,23.3 v29.45,22.85
  Bottom 0.203: v29.45,22.85 28.75,23.55 IC2.31
N$51  (via drill 0.3 pad 0.6)
  Top 0.203: R49.1 26,25.65 28.35,25.65 C44.1 28,25.3 v28,24.7
  Bottom 0.203: IC2.33 27.75,25.37 28,25.12 v28,24.7
N$52  (via drill 0.35 pad 0.6)
  Top 0.152: C44.2 27.7,26.3 R50.1
  Top 0.203: v28.75,27.55 28.4,27.2 C44.2
  Bottom 0.203: IC2.32 28.25,27.05 v28.75,27.55
N$53
  Bottom 0.152: IC2.38 25.2,26.16 C51.1
N$58
  Bottom 0.152: IC2.43 22.75,25.15 22.4,24.8 C50.1
N$63
  Bottom 0.152: IC2.48 20.25,25.35 19.55,24.65 C47.1
N$64  (via drill 0.3)
  Top 0.305: v18.55,27.55 18.1,27.55 C53.1
  Bottom 0.305: IC2.52 18.25,27.16 18.55,27.46 v18.55,27.55
N$65  (via drill 0.3)
  Top 0.762: C53.2 15.2,25.15 D2.1
  other vias: 13.65,26.15 13.65,25.5 13.65,24.85 13.65,24.2 13.65,23.55 14.3,23.5 14.95,23.5 15.6,23.5 13.95,22.95 14.6,22.95 15.25,22.95
  pour Bottom (no thermals): 19.35,26.85 19.35,24.95 17.1,22.7 13.85,22.7 13.25,23.3 13.25,26.25 13.5,26.5 13.85,26.5 15.4,24.95 18.2,24.95 18.65,25.4 18.65,26.9 19.3,26.9
  pour Top (no thermals): 7.15,25.45 12.25,25.45 13.35,26.55 15.7,26.55 15.95,26.3 15.95,23.05 15.6,22.7 13.9,22.7 12.75,23.85 7.15,23.85 6.9,24.1 6.9,25.2
N$69
  Top 0.305: D3.A R9.2
N$71
  Top 0.305: D4.A R10.2
N$73
  Top 0.305: R11.2 D5.A
PHASE_1  (via drill 0.3, 3 pad 5.5)
  Top 0.203: R45.2 31.35,22.5 v30.8,22.5
  Route15 0.305: v16.75,10.7 16.75,18.89 v20.8,22.95 21.86,24 29.3,24 v30.8,22.5
  Bottom 0.152: IC2.46 21.25,25.25 20.85,24.85 C47.2
  Bottom 0.203: C47.2 20.85,22.99 v20.8,22.95 | v16.75,10.7 15.42,10.7 M7.7
  other vias: 15.5,4 14,5.5 15.5,6 17,5.5 17.5,4 17,2.5 15.5,2 14,2.5 13.5,4
  pour Bottom (no thermals): 5.67,13.9 10,13.9 11.6,12.3 16.55,12.3 16.55,8.25 18.15,6.65 18.15,3.95 16.3,2.1 13.65,2.1 11.2,4.55 11.2,6.65 8.2,9.65 5.95,9.65 5.4,10.2 5.4,13.73
  pour Top (no thermals): 5.8,11.8 8.95,11.8 9.15,11.6 9.15,10.85 9.75,10.25 11.25,10.25 11.8,10.8 11.8,11.75 14.9,11.75 18.15,8.5 18.15,4.2 16.05,2.1 13.75,2.1 13.65,2.1 13.5,2.25 11.2,4.55 11.2,5.95 11.2,6.45 9,8.65 8.6,9.05 7.05,9.05 5.8,10.3
PHASE_2  (via drill 0.3, 3 pad 5.5)
  Top 0.203: R44.2 33.45,23.2 v33.45,21.75
  Route15 0.305: v23,10.85 19.9,13.95 19.9,20.15 21.15,21.4 23.15,21.4 23.65,21.9 v23.65,22.65 23.65,22.8 24.1,23.25 27.15,23.25 28.61,21.79 33.41,21.79 v33.45,21.75
  Bottom 0.152: IC2.41 23.75,24.1 C50.2 23.65,24 v23.65,22.65 | v23,10.85 23.16,10.85 M10.7
  other vias: 21.5,5.5 23,6 24.5,5.5 23,4 25,4 24.5,2.5 23,2 21.5,2.5 21,4
  pour Bottom (no thermals): 17.4,12.3 17.4,8.1 18.7,6.8 18.7,4.55 21.35,1.9 24.65,1.9 27.15,4.4 27.15,6.6 28.15,7.6 28.5,7.95 28.5,12.25 17.65,12.25
  pour Top (no thermals): 17.8,11.8 21,11.8 21.25,11.55 21.25,10.7 21.85,10.1 23.35,10.1 23.85,10.6 23.85,11.75 26.9,11.75 27.25,11.4 27.25,10.7 27.25,4.5 24.75,2 21.25,2 20.95,2.3 18.65,4.6 18.65,8.65 17.75,9.55 17.75,11.8
PHASE_3  (via drill 0.3, 0.3 pad 0.6, 3 pad 5.5)
  Top 0.305: R43.2 35.95,22.35 v36.05,22.35
  Route15 0.152: v26.65,22.29 26.86,22.29
  Route15 0.305: v36.05,22.35 41.8,16.6 v41.8,13.1 | v35.15,11.6 35.15,14 26.86,22.29
  Bottom 0.152: IC2.36 26.25,24.65 26.5,24.4 C51.2 26.65,23.5 v26.65,22.29 | v35.15,11.6 34.15,11.6 33.91,11.36 M11.5
  Bottom 0.305: v41.8,13.1 41.6,12.9 39.65,12.9 38.53,11.79 M12.6
  other vias: 30.5,4 29,5.5 30.5,6 32,5.5 32.5,4 32,2.5 30.5,2 29,2.5 28.5,4
  pour Bottom (no thermals): 40.33,13.9 36,13.9 34.4,12.3 29.45,12.3 29.45,8.25 27.85,6.65 27.85,3.95 29.7,2.1 32.35,2.1 34.8,4.55 34.8,6.65 37.8,9.65 40.05,9.65 40.6,10.2 40.6,13.73
  pour Top (no thermals): 29.8,11.8 29.8,10.6 29.45,10.25 27.85,8.65 27.85,3.95 29.75,2.05 32.3,2.05 34.8,4.55 34.8,6.35 34.8,6.45 37.55,9.2 38.85,10.5 38.85,11.7 38.8,11.75 35.75,11.75 35.75,11.1 35.4,10.75 35.2,10.55 33.3,10.55 32.9,10.95 32.9,11.75 32.8,11.85 29.8,11.85
SENS1
  Top 0.203: U1.16 24.83,33.25 24.85,33.23 24.85,28.2 25.95,27.1 27.25,27.1 28.35,28.2 29.4,28.2 29.75,27.85 29.75,27.1 31.2,25.65 31.2,24.3 31.4,24.1 34.25,24.1 35.05,24.9 R43.1
  Top 0.305: R46.1 R43.1
SENS2
  Top 0.203: U1.15 25.1,33.75 25.35,33.5 25.35,31.8 25.25,31.7 25.25,28.4 26.15,27.5 27,27.5 28.15,28.65 30.09,28.65 31.34,27.4 32.55,27.4 33.5,26.45 33.5,26.3
  Top 0.305: R47.1 33.5,26.3 R44.1
SENS3  (via drill 0.3, 0.35 pad 0.6)
  Top 0.203: U1.14 25.35,34.25 25.8,33.8 25.8,31.6 25.65,31.45 25.65,28.95 26.45,28.15 v26.75,28.15 | R48.1 31.28,26.5 v30.43,27.35
  Top 0.305: R48.1 32.05,26.4 R45.1
  Route15 0.305: v30.43,27.35 29.54,28.25 26.85,28.25 v26.75,28.15
SWCLK  (via drill 0.35)
  Top 0.305: U1.49 34.47,42.67 v34.5,42.7
  Bottom 0.305: v34.5,42.7 35.45,43.65 R32.2
SWDIO  (via drill 0.35)
  Top 0.203: U1.46 34.5,39.75 v34.3,39.95
  Bottom 0.203: v34.3,39.95 36.15,41.8 38.7,41.8 39.15,42.25 39.15,44.75 R23.2
TEMP_MOTOR  (via drill 0.35)
  Top 0.305: v24.3,48.15 24.1,48.35 C25.2 R16.2 | v26.45,39.2 26.4,39.15 26.4,38.45 25.2,37.25 U1.8
  Route15 0.305: v24.3,48.15 24.3,42.59 26.45,40.45 v26.45,39.2
USB_N
  Top 0.229: U1.44 36.31,38.75 36.35,38.78 37.49,38.78 38.23,39.52 38.23,40.97 R24.2
USB_P
  Top 0.229: U1.45 36.36,39.25 36.4,39.22 37.32,39.22 37.8,39.7 37.8,40.75 34.48,44.07 33.48,44.07 R31.2
V_SUPPLY  (via drill 0.3, 0.35 pad 0.6, 0.5)
  Top 0.152: 13.5,16 13.98,16 M2.6 | 18,16 18.71,16 | 18.71,16 M3.7 | 18.71,16 19.98,16 M3.6 | 30.25,16.66 31.25,16.66 M6.7
  Top 0.508: 29.5,17 29.84,16.66 30.25,16.66 | M6.8 31.25,16.66
  Top 1.016: C6.1 13.5,16 | C7.1 18,16 | C2.1 29.5,17 | C3.1 35,16.5 35.5,16 35.99,16.49 M5.8
  Route15 0.508: v19.52,37.97 19.27,37.72 19.27,31.72 16.5,28.95 v16.5,28.85
  Bottom 0.305: C41.2 31.5,28.65 31.5,26.55 | 31.5,26.55 31.16,26.21 IC2.29 31.2,26.21 31.2,25.75 C43.2 | C42.2 31.85,26.9 31.5,26.55 | R21.1 19.52,39.32 v19.52,37.97 | v16.5,28.85 16.5,28.5 16.05,28.05 C39.1
  other vias: 7,7.5 4.5,5 9.5,5 7,2.5 5,3 5,7 9,7 9,3 2.25,22.25 2.25,21.5 2.25,20.75 2.25,20 2.25,19.25 2.25,18.5 1.5,18.5 1.5,19.25 1.5,20 1.5,20.75 1.5,21.5 1.5,22.25 1.5,17.75 2.25,17.75 2.25,17 1.5,17 39.75,21.85 40.35,21.85 40.95,21.85 41.55,21.85 42.1,21.85 42.65,21.85 39.75,21.1 40.35,21.1 40.95,21.1 41.55,21.1 42.1,21.1 42.7,21.1 3,3 2.5,3.5 2,4 1.5,4.5 1.5,5.25 1.5,6 1.5,6.75 1.5,7.5 1.5,8.25 1.5,9 1.5,9.75 1.5,10.5 1.5,11.25 1.5,12 1.5,12.75 1.5,13.5 1.5,14.25 1.5,15 3,17 3.75,17 4.5,17 4.5,16.25 3.75,16.25 3,16.25 2.25,16.25 1.5,16.25
  pour Top (no thermals): 9.45,2.35 9.45,7.5 8.45,8.5 6.35,8.5 5.3,9.55 5.3,12.95 5.4,13.05 40.5,13.05 40.5,15.65 42.9,18.05 42.9,19.85 37.5,19.85 37.5,18 36.6,17.1 7.85,17.1 5.9,19.05 5.9,22.6 5.35,23.15 0.1,23.15 0.05,23.1 0.05,2.8 3.11,0.6 7.7,0.6
  pour Bottom (no thermals): 17.15,25.55 17.8,25.55 17.8,27.75 16.95,28.6 13.9,28.6 13.9,27.5 16.75,27.5 17.15,27.1
  pour Bottom (no thermals): 0.7,16.9 1.2,16.4 2.55,16.4 3.2,17.05 3.2,21.55 8.7,27.05 15.5,27.05 16,27.55 16,28.25 15.5,28.65 13.3,28.65 12.75,29.2 5.3,29.2 0.7,24.6
  pour Top (no thermals): 37.5,19.75 37.5,20.5 39,22 39.15,22.15 42.85,22.15 42.9,22.1 42.9,19.2 37.9,19.2 37.55,19.55
  pour Bottom (no thermals): 31,28.95 31,26.9 30.75,26.65 29.75,26.65 29.75,25.85 30.9,25.85 31.5,25.25 31.5,24.25 36.15,24.25 39.55,20.85 42.75,20.85 42.95,21.05 42.95,22.15 42.5,22.6 40.2,22.6 37.1,25.7 34.65,25.7 33.1,27.25 33.1,27.35 32.9,27.55 32.6,27.55 32.1,28.05 32.1,28.95
  pour Bottom (no thermals): 0.75,0.5 7.5,0.5 9.5,2.5 9.5,4.5 4.5,9.5 4.5,15.75 4.75,16 4.75,17.25 2.75,19.25 2.75,22.5 -0.25,22.5 -0.25,1.5
  pour Route15 (no thermals): 1,0.5 7.5,0.5 9.5,2.5 9.5,4.5 4.5,9.5 4.5,15.75 4.75,16 4.75,17.25 2.75,19.25 2.75,22.5 -0.25,22.5 -0.25,1.75
  pour Route2 (no thermals): 1.25,0.5 7.5,0.5 9.5,2.5 9.5,4.5 4.5,9.5 4.5,15.75 4.75,16 4.75,17.25 2.75,19.25 2.75,22.5 -0.25,22.5 -0.25,2
VCC  (via drill 0.3, 0.35, 0.35 pad 0.6)
  Top 0.152: v27.67,32.57 27.25,32.15 U1.19 | 22.5,34.05 C27.1
  Top 0.203: U1.13 23.2,34.75 22.5,34.05 | R11.1 38.8,33.15 v38,33.15 | C37.1 35.95,30.9 v35.55,31.3 33.78,31.3 U1.32 | U5.3 11.37,48.23 | 11.37,48.23 11.37,48.28 | 11.37,48.23 v11.35,48.25 | U1.19 27.25,30.45 27.7,30 C36.1
  Top 0.305: 26.25,41.65 U1.64 25.25,43.67 25.25,44 25.05,43.8 C38.1 24.85,43.9 | 26.25,41.65 26.05,41.45 | 26.05,41.45 25.35,40.75 U1.1 24.33,41.89 C21.1 | U1.48 33.75,40.75 33.49,40.49 28.62,40.49 | 28.62,40.49 28.33,40.49 | 26.25,41.65 26.45,41.45 | R8.1 R7.1 R6.1 R16.1 23.3,44.85 23.9,44.85 24.85,43.9 | C35.1 25.1,44.15 24.85,43.9 | TMP.2 42.75,14.2 44.3,15.75 44.3,30.6 42.85,32.05 39.85,32.05 39.7,31.9 37.65,31.9 36.7,30.95 C37.1 | U1.13 25.49,34.75 | 25.49,34.75 v27.67,32.57 | C27.1 22,34 21,33 20.1,33 | v9,32.8 9.2,33 20.1,33 | 25.49,34.75 25.49,35.34 28.33,38.19 28.33,40.2 | 28.33,40.49 28.33,40.2 | 26.05,41.45 26.45,41.45 | C10.2 9,37.5 C11.1 | 20.1,33 20.1,32.5 v20.2,32.4 19.57,32.4 19.15,31.98 C40.1 | 26.45,41.45 27.41,40.49 28.04,40.49 | 28.04,40.49 28.33,40.49 | 28.04,40.49 28.33,40.2 | 28.33,40.2 28.62,40.49
  Top 0.508: R8.1 15.5,46.65 14.75,47.4 14.75,47.8 13.3,49.25 11.9,49.25 11.37,48.72 11.37,48.28
  Route15 0.508: v27.67,32.57 28.24,32 33.75,32 36.75,35 37.5,35 38,34.5 v38,33.15
  Bottom 0.152: IC2.24 27.75,32.65 v27.67,32.57
  Bottom 0.305: v38,33.15 36.15,31.3 v35.55,31.3 | v11.35,48.25 C26.1 | IC2.9 20.25,32.45 v20.2,32.4
  Bottom 0.508: v9,35.2 9,45.2 10.15,46.35 C26.1
  other vias: 9,34.4 9,33.6 8.2,32.8 8.2,33.6 8.2,34.4 8.2,35.2
  pour Bottom (no thermals): 3.55,34.45 6.8,34.45 7.85,35.5 11.45,35.5 11.45,32.5 7.9,32.5 6.8,33.6 3.55,33.6
  pour Top (no thermals): 6.15,40.55 7.85,40.55 10.1,38.3 11.15,38.3 11.15,37.25 9.4,35.5 9.4,32.7 9.2,32.5 7.95,32.5 7.8,32.65 7.8,36.65 6.15,38.3

### Text on the board
tPlace: EarthSense ESC V1 | V+ | GND
tNames: + | + | + | +